# Altium project superhet1.PrjPcb (part 1 of 2)
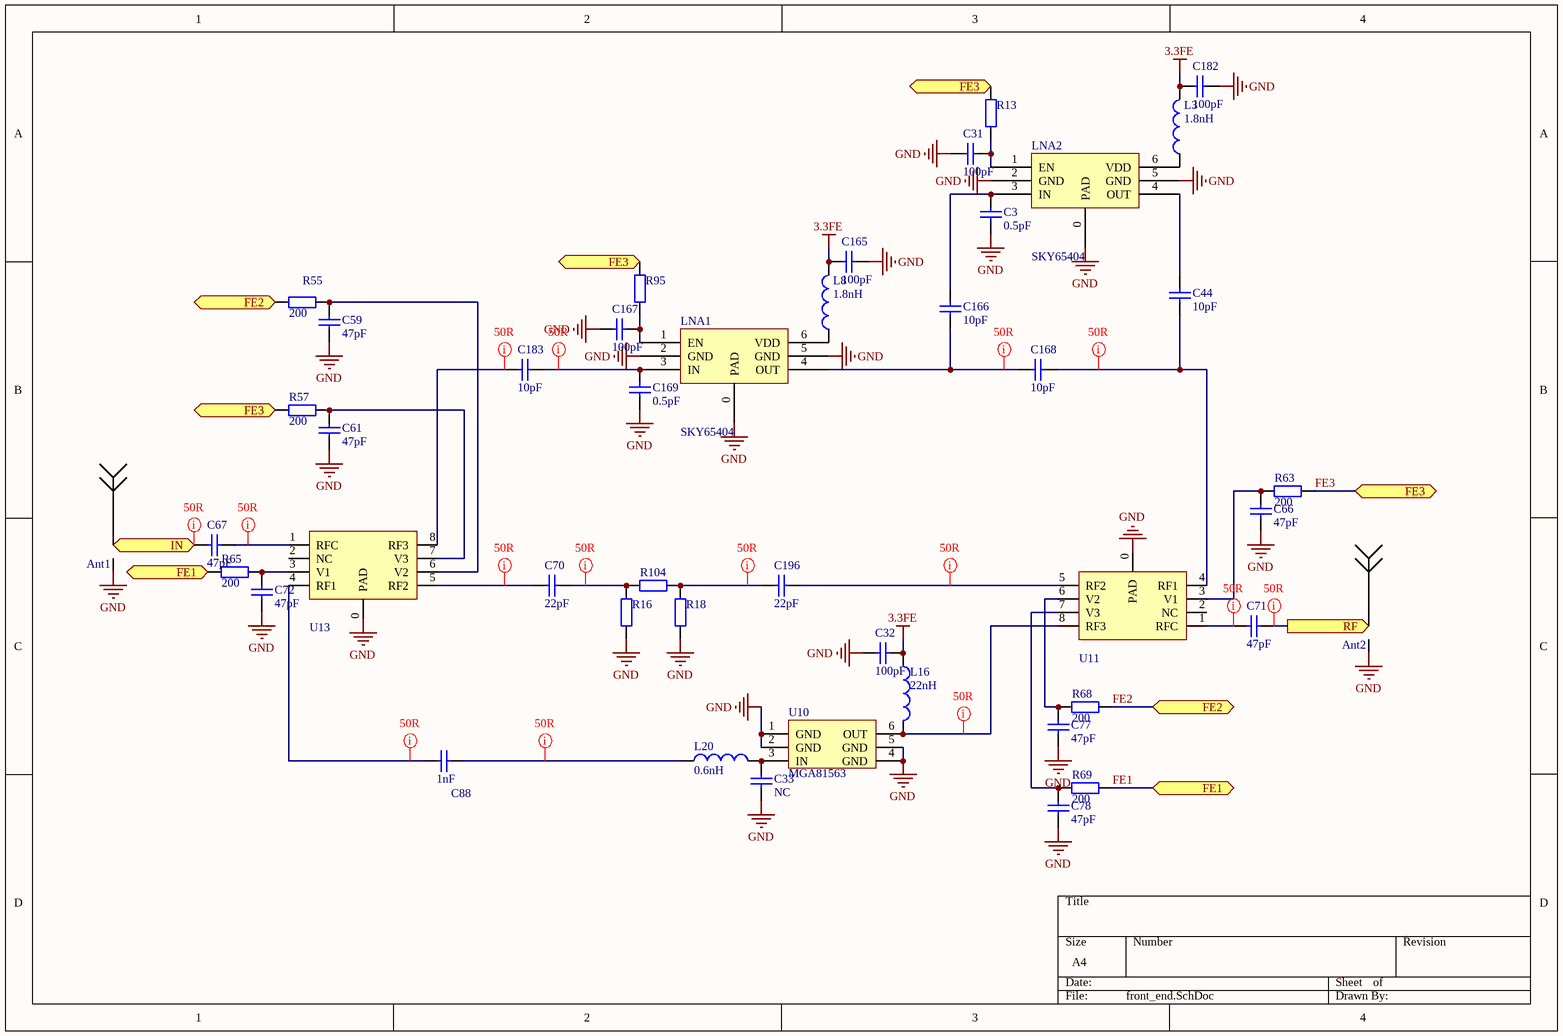
[diagram p0: front_end.SchDoc]
9 sheets, 440 parts. Net scope: flat (ports and power ports of the same name join across sheets).
Board file: superhet1.PcbDoc
Sheets:
  front_end.SchDoc
  mix1_LO1.SchDoc
  mix2_LO2.SchDoc
  LF_ADC.SchDoc
  FPGA.SchDoc
  mcu.SchDoc
  USB_HS_PHY.SchDoc
  power.SchDoc
  clock.SchDoc

## Sheet front_end.SchDoc
size A4

### Parts
Ant1  Antenna  [SMA-2]  (value not drawn)
Ant2  Antenna  [SMA-SMT]  (value not drawn)
C3  value 0.5pF  [0402]  (hidden comment: Cap)
C31  value 100pF  [0402]  (hidden comment: Cap)
C32  value 100pF  [0402]  (hidden comment: Cap)
C33  value NC  [0402]  (hidden comment: Cap)
C44  10pF  [0402]
C59  47pF  [0402]
C61  47pF  [0402]
C66  47pF  [0402]
C67  47pF  [0402]
C70  22pF  [0402]
C71  47pF  [0402]
C72  47pF  [0402]
C77  47pF  [0402]
C78  47pF  [0402]
C88  1nF  [0402]
C165  value 100pF  [0402]  (hidden comment: Cap)
C166  10pF  [0402]
C167  value 100pF  [0402]  (hidden comment: Cap)
C168  10pF  [0402]
C169  value 0.5pF  [0402]  (hidden comment: Cap)
C182  value 100pF  [0402]  (hidden comment: Cap)
C183  10pF  [0402]
C196  22pF  [0402]
L3  value 1.8nH  [0402]  (hidden comment: Inductor)
L8  value 1.8nH  [0402]  (hidden comment: Inductor)
L16  value 22nH  [0603]  (hidden comment: Inductor)
L20  value 0.6nH  [0402]  (hidden comment: Inductor)
LNA1  SKY65404  [SKY65404-31]
LNA2  SKY65404  [SKY65404-31]
R13  200R  [0402]  (value not drawn)
R16  TBD  [0402]  (value not drawn)
R18  TBD  [0402]  (value not drawn)
R55  200  [0402]
R57  200  [0402]
R63  200  [0402]
R65  200  [0402]
R68  200  [0402]
R69  200  [0402]
R95  200R  [0402]  (value not drawn)
R104  TBD  [0402]  (value not drawn)
U10  MGA81563  [SC-70-6]
U11  SKY13417  [SKY13317]  (value not drawn)
U13  SKY13417  [SKY13317]  (value not drawn)

### Ports
FE1, FE2, FE3, IN (in), RF (out)

### Nets
3.3FE: C32.2 C165.2 C182.2 L3.2 L8.2 L16.1
GND: Ant1.GND(G) Ant2.GND(G) C3.1 C31.2 C32.1 C33.1 C59.1 C61.1 C66.1 C72.1 C77.1 C78.1 C165.1 C167.2 C169.1 C182.1 LNA1.0(PAD) LNA1.2(GND) LNA1.5(GND) LNA2.0(PAD) LNA2.2(GND) LNA2.5(GND) R16.1 R18.2 U10.1(GND) U10.2(GND) U10.4(GND) U10.5(GND) U11.0(PAD) U13.0(PAD)
FE1: R65.1 R69.2 ; port FE1
FE2: R55.2 R68.2 ; port FE2
FE3: R13.2 R57.1 R63.2 R95.2 ; port FE3
NetAnt1_1: Ant1.1 C67.2 ; port IN
NetAnt2_1: Ant2.1 C71.1 ; port RF
NetC3_2: C3.2 C166.1 LNA2.3(IN)
NetC31_1: C31.1 LNA2.1(EN) R13.1
NetC33_2: C33.2 L20.2 U10.3(IN)
NetC44_1: C44.1 C168.1 U11.4(RF1)
NetC44_2: C44.2 LNA2.4(OUT)
NetC59_2: C59.2 R55.1 U13.6(V2)
NetC61_2: C61.2 R57.2 U13.7(V3)
NetC66_2: C66.2 R63.1 U11.3(V1)
NetC67_1: C67.1 U13.1(RFC)
NetC70_1: C70.1 R16.2 R104.2
NetC70_2: C70.2 U13.5(RF2)
NetC71_2: C71.2 U11.1(RFC)
NetC72_2: C72.2 R65.2 U13.3(V1)
NetC77_2: C77.2 R68.1 U11.6(V2)
NetC78_2: C78.2 R69.1 U11.7(V3)
NetC88_1: C88.1 L20.1
NetC88_2: C88.2 U13.4(RF1)
NetC166_2: C166.2 C168.2 LNA1.4(OUT)
NetC167_1: C167.1 LNA1.1(EN) R95.1
NetC169_2: C169.2 C183.2 LNA1.3(IN)
NetC183_1: C183.1 U13.8(RF3)
NetC196_1: C196.1 U11.5(RF2)
NetC196_2: C196.2 R18.1 R104.1
NetL3_1: L3.1 LNA2.6(VDD)
NetL8_1: L8.1 LNA1.6(VDD)
NetL16_2: L16.2 U10.6(OUT) U11.8(RF3)

Not connected (* = marked no-connect by the designer): U11 2(NC); U13 2(NC)

### Layout directives
net class 50R: NetAnt1_1, NetAnt2_1, NetC44_1, NetC67_1, NetC70_1, NetC70_2, NetC71_2, NetC88_1, NetC88_2, NetC166_2, NetC169_2, NetC183_1, NetC196_1, NetC196_2, NetL16_2

### Library data of the parts
C3 C31-C33 C44 C59 C61 C66 C67 C70-C72 C77 C78 C88 C165-C169 C182 C183 C196 = Cap: Capacitor; Published: 8-Jun-2000; LatestRevisionDate: 17-Jul-2002; LatestRevisionNote: Re-released for DXP Platform.; PackageReference: RAD-0.3; Publisher: Altium Limited; PackageDescription: Radial Cap, Thru-Hole; 2 Leads; 0.3 in Pin Spacing
L3 L8 L16 L20 = Inductor: Code_IEC: 1005; Published: 8-Jun-2000; LatestRevisionDate: 29-May-2009; LatestRevisionNote: IPC-7351 Footprint Added.; PackageReference: 0402-A; Publisher: Altium Limited; PackageDescription: Chip Inductor; Code_JEITA: 0402
LNA1 LNA2 = SKY65404-31
R13 R16 R18 R55 R57 R63 R65 R68 R69 R95 R104 = Res2: Resistor; Published: 8-Jun-2000; LatestRevisionDate: 17-Jul-2002; LatestRevisionNote: Re-released for DXP Platform.; PackageReference: AXIAL-0.4; Publisher: Altium Limited; PackageDescription: Axial Device, Thru-Hole; 2 Leads; 0.4 in Pin Spacing

## Sheet mix1_LO1.SchDoc
size A3
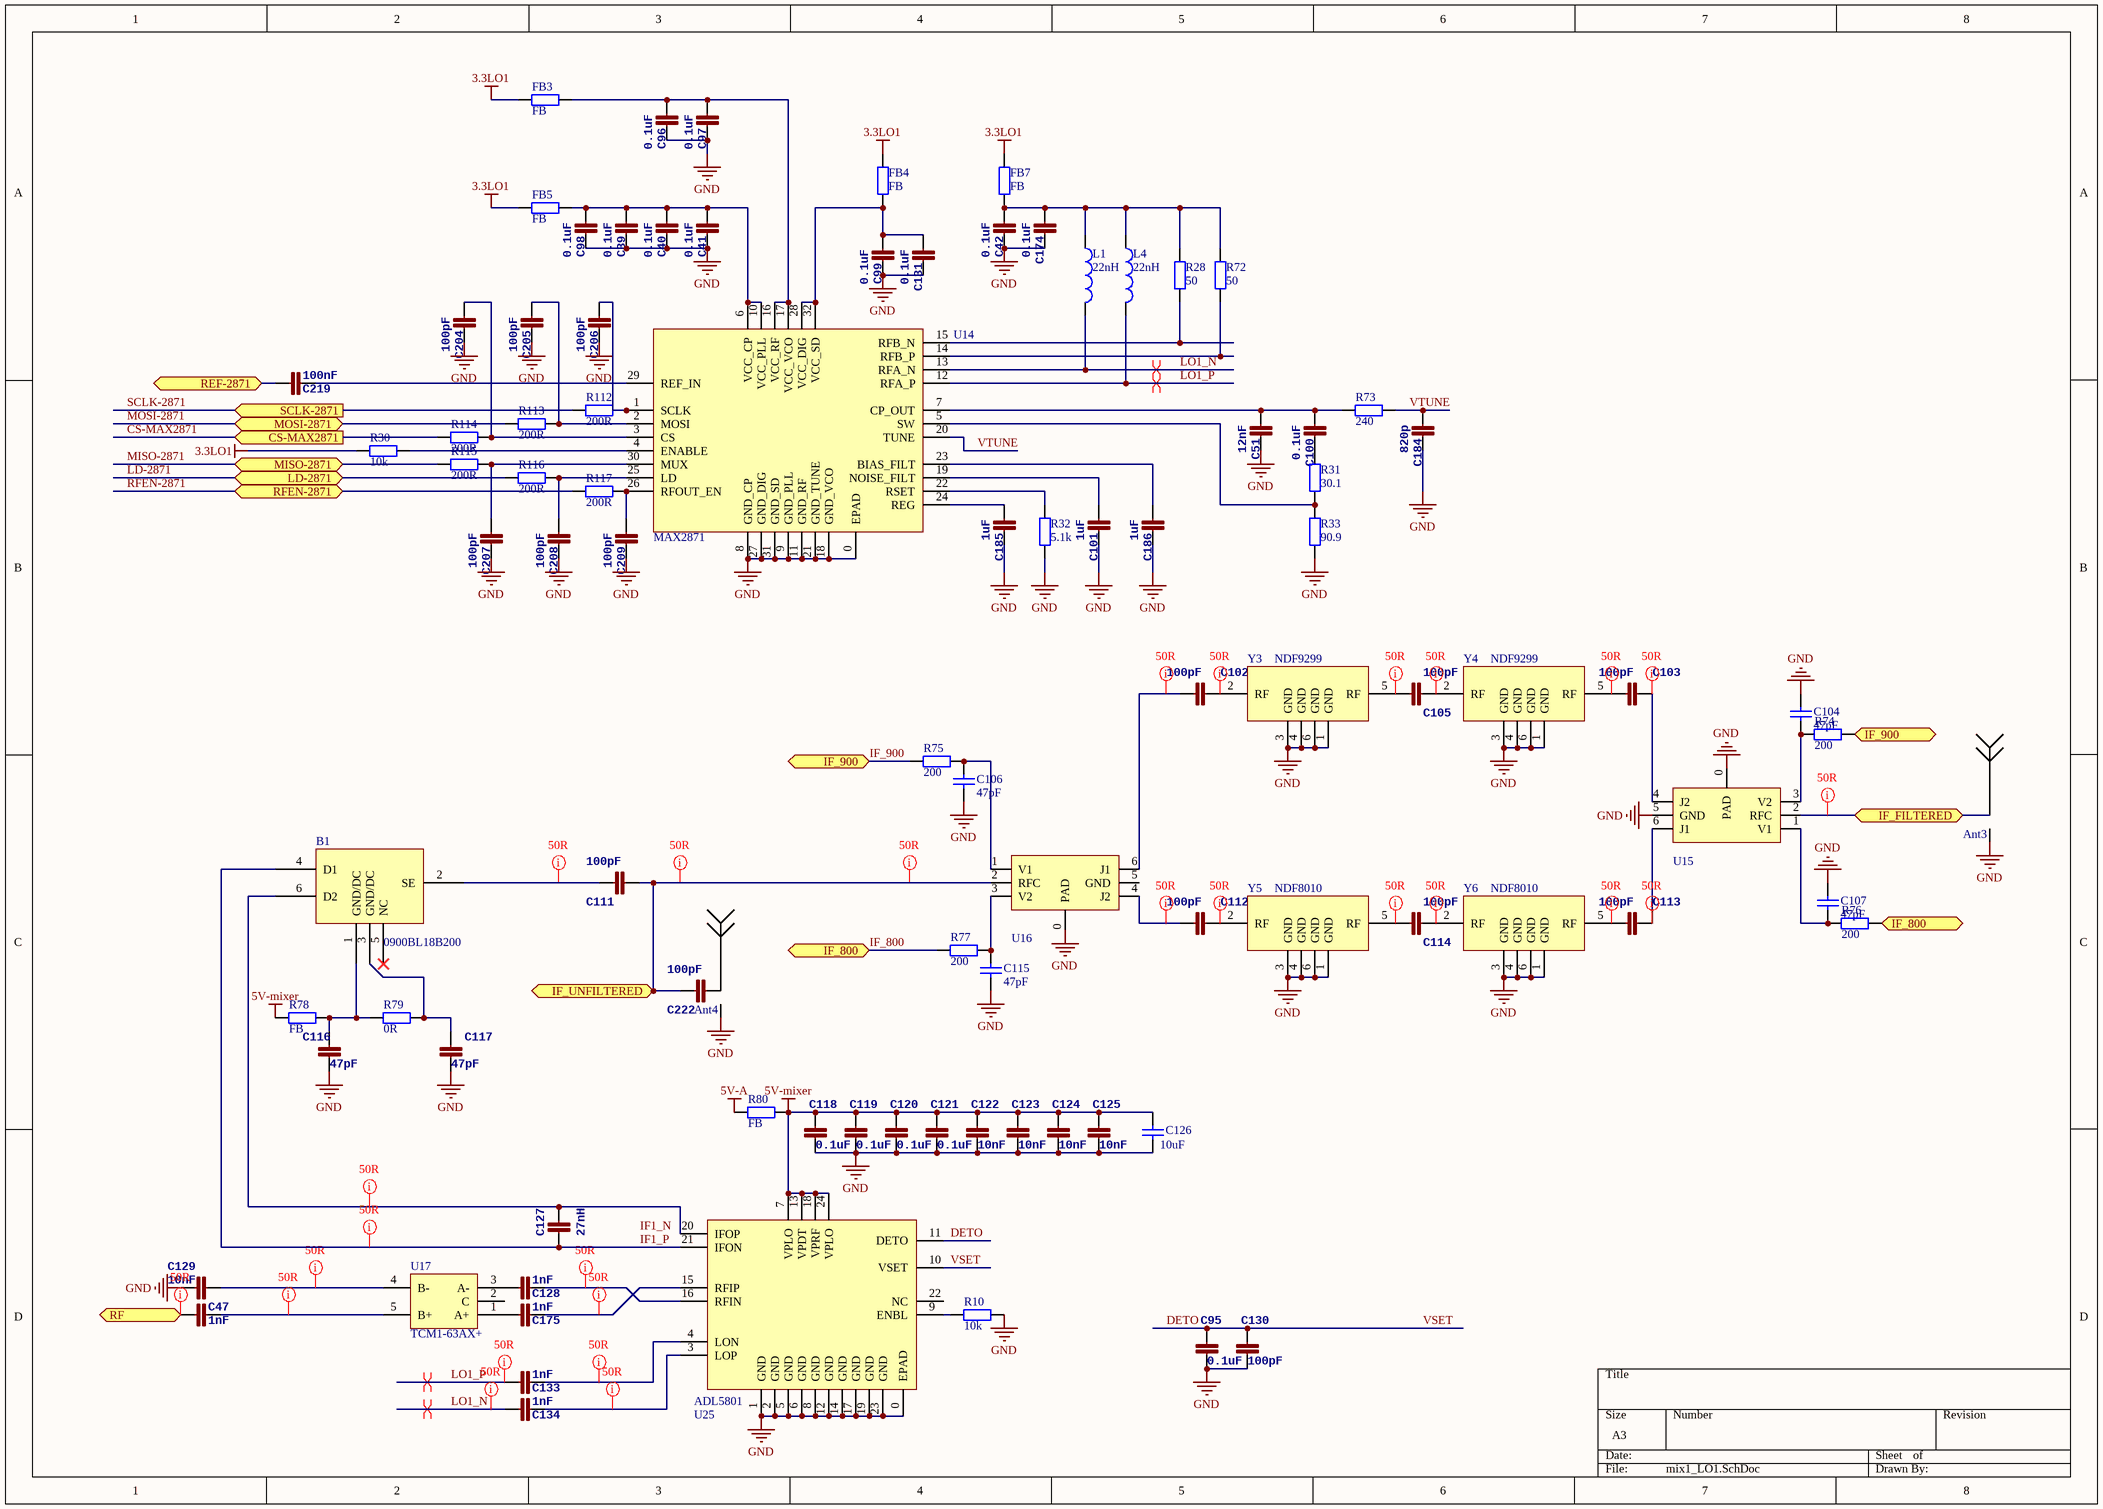
[diagram p1: mix1_LO1.SchDoc]

### Parts
Ant3  Antenna  [SMA-SMT]  (value not drawn)
Ant4  Antenna  [SMA-SMT]  (value not drawn)
B1  0900BL18B200  [0900BL18B200]
C39  0.1uF  [0402]
C40  0.1uF  [0402]
C41  0.1uF  [0402]
C42  0.1uF  [0402]
C47  1nF  [0402]
C51  12nF  [0402]
C95  0.1uF  [0402]
C96  0.1uF  [0402]
C97  0.1uF  [0402]
C98  0.1uF  [0402]
C99  0.1uF  [0402]
C100  0.1uF  [0402]
C101  1uF  [0402]
C102  100pF  [0402]
C103  100pF  [0402]
C104  47pF  [0402]
C105  100pF  [0402]
C106  47pF  [0402]
C107  47pF  [0402]
C111  100pF  [0402]
C112  100pF  [0402]
C113  100pF  [0402]
C114  100pF  [0402]
C115  47pF  [0402]
C116  47pF  [0402]
C117  47pF  [0402]
C118  0.1uF  [0402]
C119  0.1uF  [0402]
C120  0.1uF  [0402]
C121  0.1uF  [0402]
C122  10nF  [0402]
C123  10nF  [0402]
C124  10nF  [0402]
C125  10nF  [0402]
C126  10uF  [0805]
C127  27nH  [0402]
C128  1nF  [0402]
C129  10nF  [0402]
C130  100pF  [0402]
C131  0.1uF  [0402]
C133  1nF  [0402]
C134  1nF  [0402]
C174  0.1uF  [0402]
C175  1nF  [0402]
C184  820p  [0402]
C185  1uF  [0402]
C186  1uF  [0402]
C204  100pF  [0402]
C205  100pF  [0402]
C206  100pF  [0402]
C207  100pF  [0402]
C208  100pF  [0402]
C209  100pF  [0402]
C219  100nF  [0402]
C222  100pF  [0402]
FB3  FB  [0603]
FB4  FB  [0603]
FB5  FB  [0603]
FB7  FB  [0603]
L1  value 22nH  [0402]  (hidden comment: Inductor)
L4  value 22nH  [0402]  (hidden comment: Inductor)
R10  value 10k  [0402]  (hidden comment: Res2)
R28  50  [0402]
R30  10k  [0402]
R31  30.1  [0402]
R32  5.1k  [0402]
R33  90.9  [0402]
R72  50  [0402]
R73  240  [0402]
R74  200  [0402]
R75  200  [0402]
R76  200  [0402]
R77  200  [0402]
R78  FB  [0402]
R79  0R  [0402]
R80  FB  [0603]
R112  200R  [0402]
R113  200R  [0402]
R114  200R  [0402]
R115  200R  [0402]
R116  200R  [0402]
R117  200R  [0402]
U14  MAX2871  [MAX2871]
U15  SKY13320  [SKY65404-31]  (value not drawn)
U16  SKY13320  [SKY65404-31]  (value not drawn)
U17  TCM1-63AX+  [TCM-63AX+]
U25  ADL5801  [ADL5801]
Y3  NDF9299  [NDF8010]
Y4  NDF9299  [NDF8010]
Y5  NDF8010  [NDF8010]
Y6  NDF8010  [NDF8010]

### Ports
CS-MAX2871 (in), IF_800, IF_900, IF_FILTERED, IF_UNFILTERED, LD-2871, MISO-2871, MOSI-2871, REF-2871, RF, RFEN-2871, SCLK-2871 (in)

### Nets
3.3LO1: FB3.2 FB4.1 FB5.2 FB7.1 R30.2
5V-A: R80.1
5V-mixer: C118.2 C119.2 C120.2 C121.2 C122.2 C123.2 C124.2 C125.2 C126.2 R78.1 R80.2 U25.7(VPLO) U25.13(VPDT) U25.18(VPRF) U25.24(VPLO)
GND: Ant3.GND(G) Ant4.GND(G) C39.2 C40.2 C41.2 C42.2 C47.1 C51.2 C95.1 C96.2 C97.2 C98.2 C99.2 C101.2 C104.1 C106.1 C107.1 C115.1 C116.1 C117.1 C118.1 C119.1 C120.1 C121.1 C122.1 C123.1 C124.1 C125.1 C126.1 C130.1 C131.2 C174.2 C184.2 C185.2 C186.2 C204.2 C205.2 C206.2 C207.2 C208.2 C209.2 R10.2 R32.1 R33.1 U14.0(EPAD) U14.8(GND_CP) U14.9(GND_PLL) U14.11(GND_RF) U14.18(GND_VCO) U14.21(GND_TUNE) U14.27(GND_DIG) U14.31(GND_SD) U15.0(PAD) U15.5(GND) U16.0(PAD) U25.0(EPAD) U25.1(GND) U25.2(GND) U25.5(GND) U25.6(GND) U25.8(GND) U25.12(GND) U25.14(GND) U25.17(GND) U25.19(GND) U25.23(GND) Y3.1(GND) Y3.3(GND) Y3.4(GND) Y3.6(GND) Y4.1(GND) Y4.3(GND) Y4.4(GND) Y4.6(GND) Y5.1(GND) Y5.3(GND) Y5.4(GND) Y5.6(GND) Y6.1(GND) Y6.3(GND) Y6.4(GND) Y6.6(GND)
CS-MAX2871: R114.2 ; port CS-MAX2871
DETO: C95.2 C130.2 U25.10(VSET) U25.11(DETO)  [also labelled VSET]
IF1_P: B1.4(D1) C127.2 U25.21(IFON)
IF_800: R76.1 R77.1 ; port IF_800
IF_900: R74.1 R75.1 ; port IF_900
LD-2871: R116.2 ; port LD-2871
LO1_N: C134.1 L1.2 U14.13(RFA_N)
LO1_P: C133.1 L4.2 U14.12(RFA_P)
MISO-2871: R115.2 ; port MISO-2871
MOSI-2871: R113.2 ; port MOSI-2871
RFEN-2871: R117.2 ; port RFEN-2871
SCLK-2871: R112.2 ; port SCLK-2871
VTUNE: C184.1 R73.1 U14.20(TUNE)
NetAnt2_1: C129.2 ; port RF
NetAnt3_1: Ant3.1 U15.2(RFC) ; port IF_FILTERED
NetAnt4_1: Ant4.1 C222.1
NetB1_1: B1.1(GND/DC) C116.2 R78.2 R79.1
NetB1_2: B1.2(SE) C111.2
NetB1_3: B1.3(GND/DC) C117.2 R79.2
NetB1_6: B1.6(D2) C127.1 U25.20(IFOP)
NetC39_1: C39.1 C40.1 C41.1 C98.1 FB5.1 U14.6(VCC_CP) U14.10(VCC_PLL)
NetC42_1: C42.1 C174.1 FB7.2 L1.1 L4.1 R28.1 R72.1
NetC47_2: C47.2 U17.4(B-)
NetC51_1: C51.1 C100.1 R73.2 U14.7(CP_OUT)
NetC96_1: C96.1 C97.1 FB3.1 U14.16(VCC_RF) U14.17(VCC_VCO)
NetC99_1: C99.1 C131.1 FB4.2 U14.28(VCC_DIG) U14.32(VCC_SD)
NetC100_2: C100.2 R31.2
NetC101_1: C101.1 U14.19(NOISE_FILT)
NetC102_1: C102.1 Y3.2(RF)
NetC102_2: C102.2 U16.6(J1)
NetC103_1: C103.1 U15.4(J2)
NetC103_2: C103.2 Y4.5(RF)
NetC104_2: C104.2 R74.2 U15.3(V2)
NetC105_1: C105.1 Y4.2(RF)
NetC105_2: C105.2 Y3.5(RF)
NetC106_2: C106.2 R75.2 U16.1(V1)
NetC107_2: C107.2 R76.2 U15.1(V1)
NetC111_1: C111.1 C222.2 U16.2(RFC) ; port IF_UNFILTERED
NetC112_1: C112.1 Y5.2(RF)
NetC112_2: C112.2 U16.4(J2)
NetC113_1: C113.1 U15.6(J1)
NetC113_2: C113.2 Y6.5(RF)
NetC114_1: C114.1 Y6.2(RF)
NetC114_2: C114.2 Y5.5(RF)
NetC115_2: C115.2 R77.2 U16.3(V2)
NetC128_1: C128.1 U17.3(A-)
NetC128_2: C128.2 U25.16(RFIN)
NetC129_1: C129.1 U17.5(B+)
NetC133_2: C133.2 U25.4(LON)
NetC134_2: C134.2 U25.3(LOP)
NetC175_1: C175.1 U17.1(A+)
NetC175_2: C175.2 U25.15(RFIP)
NetC185_1: C185.1 U14.24(REG)
NetC186_1: C186.1 U14.23(BIAS_FILT)
NetC204_1: C204.1 R114.1 U14.3(CS)
NetC205_1: C205.1 R113.1 U14.2(MOSI)
NetC206_1: C206.1 R112.1 U14.1(SCLK)
NetC207_1: C207.1 R115.1 U14.30(MUX)
NetC208_1: C208.1 R116.1 U14.25(LD)
NetC209_1: C209.1 R117.1 U14.26(RFOUT_EN)
NetC219_1: C219.1 ; port REF-2871
NetC219_2: C219.2 U14.29(REF_IN)
NetR10_1: R10.1 U25.9(ENBL)
NetR28_2: R28.2 U14.15(RFB_N)
NetR30_1: R30.1 U14.4(ENABLE)
NetR31_1: R31.1 R33.2 U14.5(SW)
NetR32_2: R32.2 U14.22(RSET)
NetR72_2: R72.2 U14.14(RFB_P)

Not connected (* = marked no-connect by the designer): B1 5(NC)*; U16 5(GND); U17 2(C); U25 22(NC)

### Layout directives
differential pair: LO1_N, LO1_P
net class 50R: IF1_P, LO1_N, LO1_P, NetAnt2_1, NetAnt3_1, NetB1_2, NetB1_6, NetC47_2, NetC102_1, NetC102_2, NetC103_1, NetC103_2, NetC105_1, NetC105_2, NetC111_1, NetC112_1, NetC112_2, NetC113_1, NetC113_2, NetC114_1, NetC114_2, NetC128_2, NetC129_1, NetC133_2, NetC134_2, NetC175_2

### Notes on the sheet
- Labels drawn without touching a wire or pin: IF1_N

### Library data of the parts
C39-C42 C47 C51 C95-C103 C105 C111-C114 C116-C125 C127-C131 C133 C134 C174 C175 C184-C186 C204-C209 C219 C222 = CAP0402-CAP: <b>Capacitor</b> / Standard 0603 ceramic capacitor, and 0.1" leaded capacitor.; PARTNO: CC0402ZRY5V7BB104
C104 C106 C107 C115 C126 = Cap: Capacitor; Published: 8-Jun-2000; LatestRevisionDate: 17-Jul-2002; LatestRevisionNote: Re-released for DXP Platform.; PackageReference: RAD-0.3; Publisher: Altium Limited; PackageDescription: Radial Cap, Thru-Hole; 2 Leads; 0.3 in Pin Spacing
FB3-FB5 FB7 R10 R28 R30-R33 R72-R77 R112-R117 = Res2: Resistor; Published: 8-Jun-2000; LatestRevisionDate: 17-Jul-2002; LatestRevisionNote: Re-released for DXP Platform.; PackageReference: AXIAL-0.4; Publisher: Altium Limited; PackageDescription: Axial Device, Thru-Hole; 2 Leads; 0.4 in Pin Spacing
L1 L4 = Inductor: Code_IEC: 1005; Published: 8-Jun-2000; LatestRevisionDate: 29-May-2009; LatestRevisionNote: IPC-7351 Footprint Added.; PackageReference: 0402-A; Publisher: Altium Limited; PackageDescription: Chip Inductor; Code_JEITA: 0402
R78-R80 = Res2: Resistor; Value: 0Ohm; Published: 8-Jun-2000; LatestRevisionDate: 17-Jul-2002; LatestRevisionNote: Re-released for DXP Platform.; PackageReference: AXIAL-0.4; Publisher: Altium Limited; PackageDescription: Axial Device, Thru-Hole; 2 Leads; 0.4 in Pin Spacing
U17 = TCM-63AX+
Y3 Y4 = NDF8010

## Sheet mix2_LO2.SchDoc
size A3
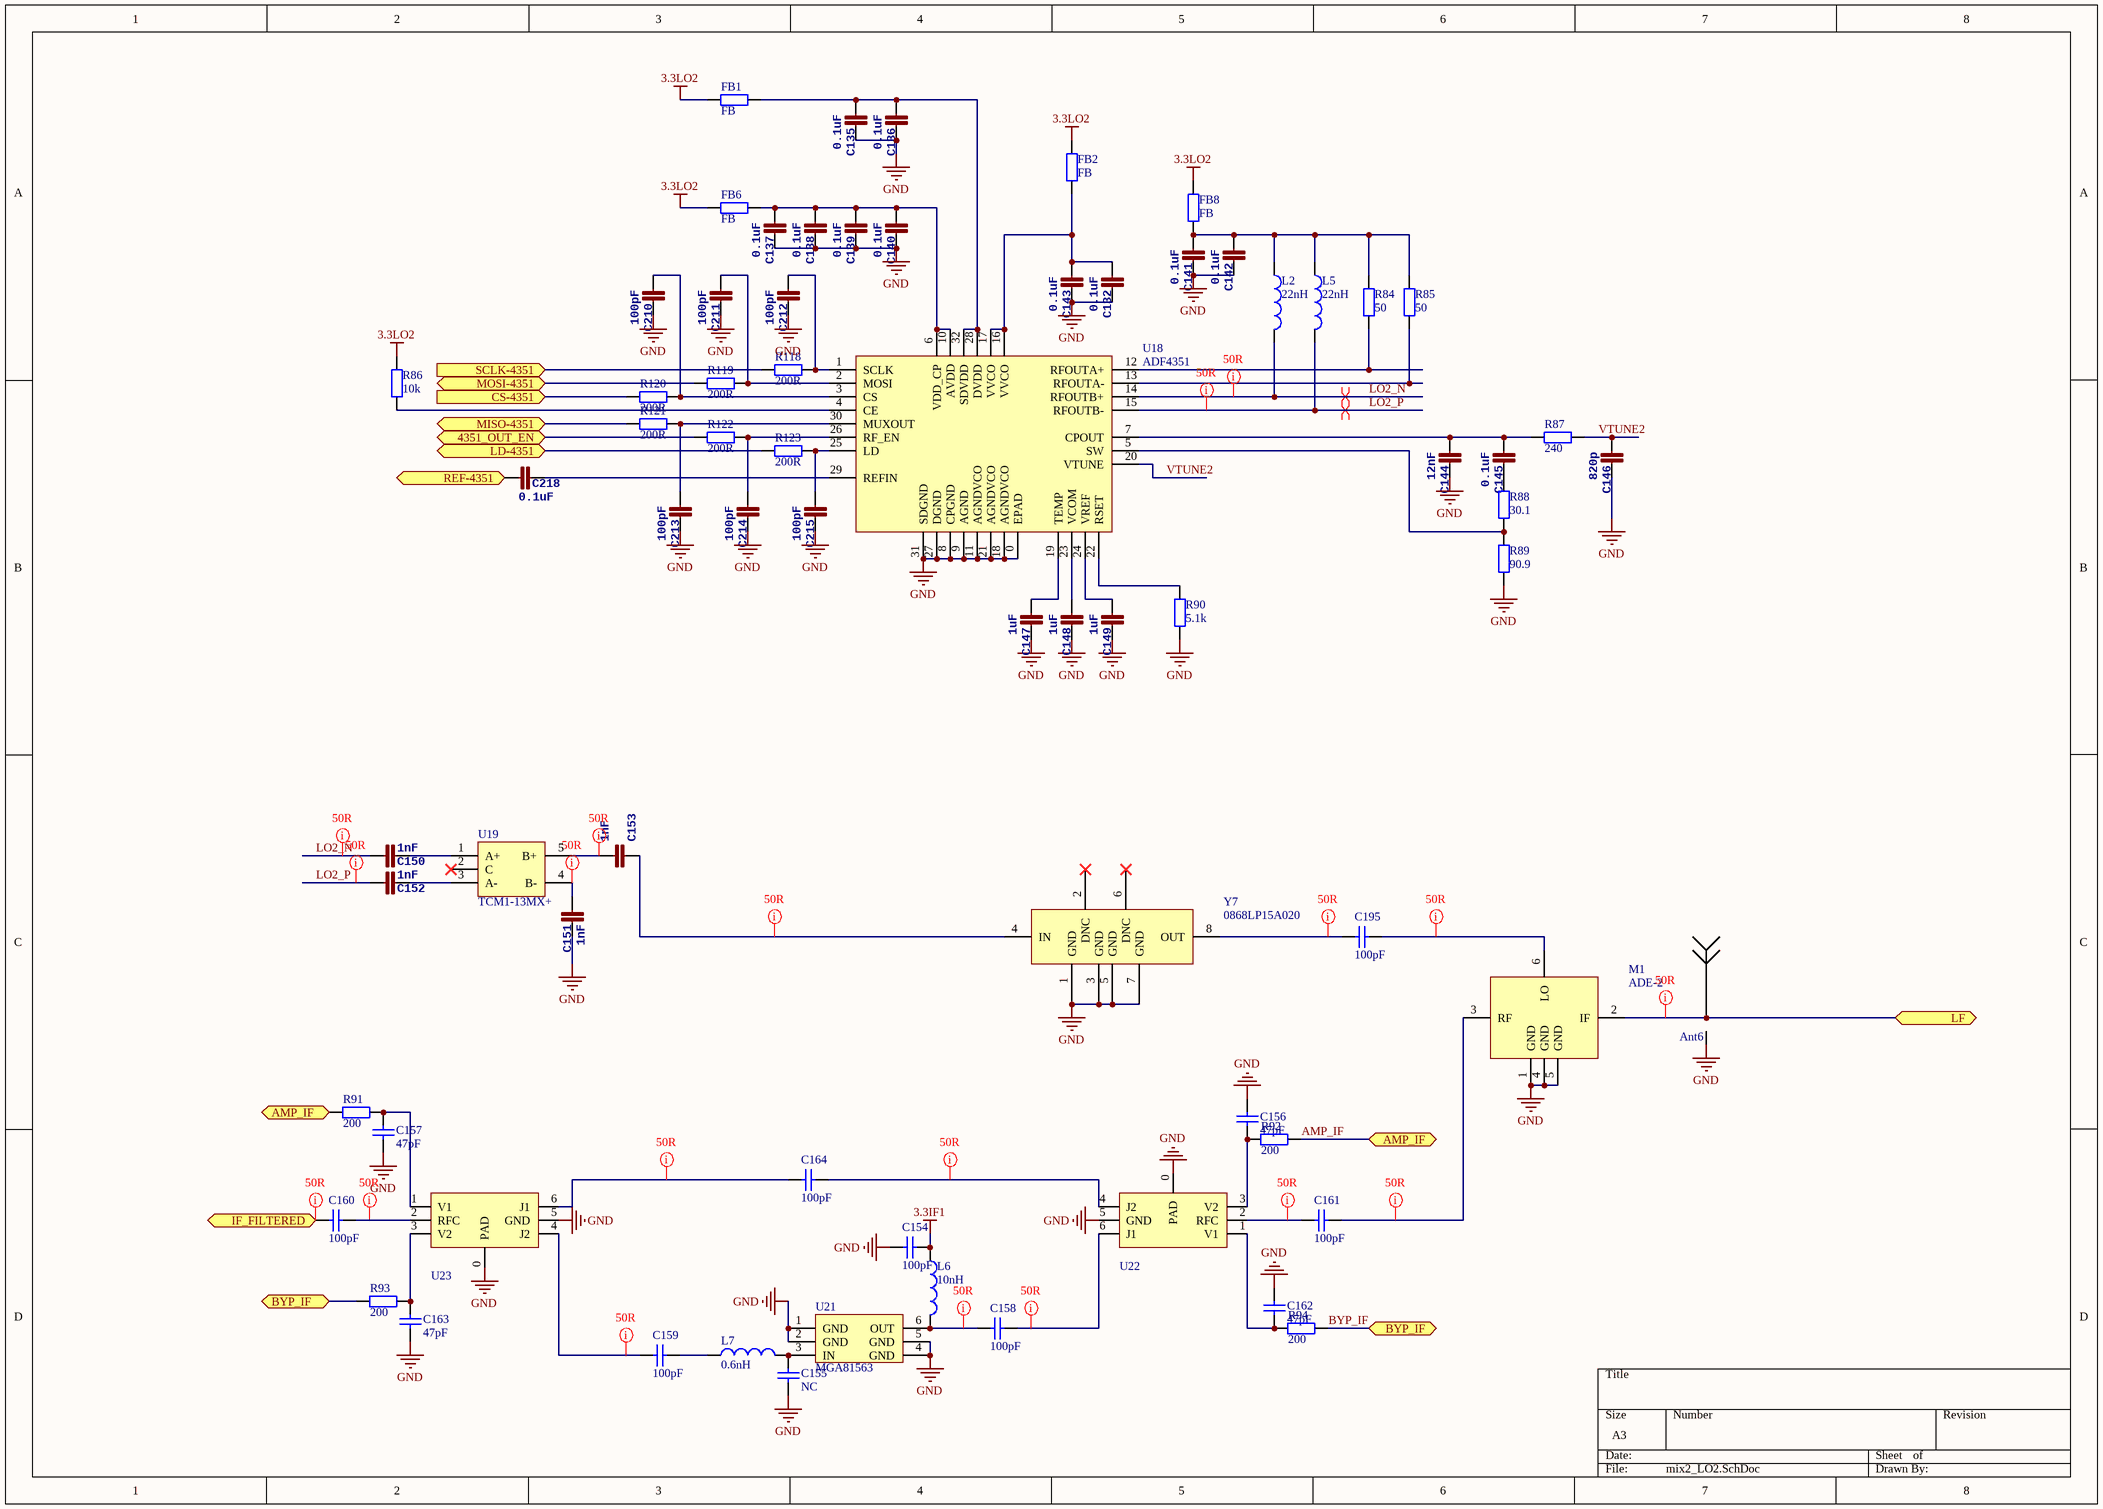
[diagram p2: mix2_LO2.SchDoc]

### Parts
Ant6  Antenna  [SMA-SMT]  (value not drawn)
C132  0.1uF  [0402]
C135  0.1uF  [0402]
C136  0.1uF  [0402]
C137  0.1uF  [0402]
C138  0.1uF  [0402]
C139  0.1uF  [0402]
C140  0.1uF  [0402]
C141  0.1uF  [0402]
C142  0.1uF  [0402]
C143  0.1uF  [0402]
C144  12nF  [0402]
C145  0.1uF  [0402]
C146  820p  [0402]
C147  1uF  [0402]
C148  1uF  [0402]
C149  1uF  [0402]
C150  1nF  [0402]
C151  1nF  [0402]
C152  1nF  [0402]
C153  1nF  [0402]
C154  value 100pF  [0402]  (hidden comment: Cap)
C155  value NC  [0402]  (hidden comment: Cap)
C156  47pF  [0402]
C157  47pF  [0402]
C158  value 100pF  [0402]  (hidden comment: Cap)
C159  value 100pF  [0402]  (hidden comment: Cap)
C160  100pF  [0402]
C161  100pF  [0402]
C162  47pF  [0402]
C163  47pF  [0402]
C164  value 100pF  [0402]  (hidden comment: Cap)
C195  100pF  [0402]
C210  100pF  [0402]
C211  100pF  [0402]
C212  100pF  [0402]
C213  100pF  [0402]
C214  100pF  [0402]
C215  100pF  [0402]
C218  0.1uF  [0402]
FB1  FB  [0603]
FB2  FB  [0603]
FB6  FB  [0603]
FB8  FB  [0603]
L2  value 22nH  [0402]  (hidden comment: Inductor)
L5  value 22nH  [0402]  (hidden comment: Inductor)
L6  value 10nH  [0603]  (hidden comment: Inductor)
L7  value 0.6nH  [0402]  (hidden comment: Inductor)
M1  ADE-2  [ADE-2]
R84  50  [0402]
R85  50  [0402]
R86  10k  [0402]
R87  240  [0402]
R88  30.1  [0402]
R89  90.9  [0402]
R90  5.1k  [0402]
R91  200  [0402]
R92  200  [0402]
R93  200  [0402]
R94  200  [0402]
R118  200R  [0402]
R119  200R  [0402]
R120  200R  [0402]
R121  200R  [0402]
R122  200R  [0402]
R123  200R  [0402]
U18  ADF4351  [ADF4351]
U19  TCM1-13MX+  [TCM-63AX+]
U21  MGA81563  [SC-70-6]
U22  SKY13320  [SKY65404-31]  (value not drawn)
U23  SKY13320  [SKY65404-31]  (value not drawn)
Y7  0868LP15A020  [5515LP15A730/0868LP15A020]

### Ports
4351_OUT_EN, AMP_IF, BYP_IF, CS-4351 (in), IF_FILTERED, LD-4351, LF, MISO-4351, MOSI-4351, REF-4351, SCLK-4351 (in)

### Nets
3.3IF1: C154.2 L6.1
3.3LO2: FB1.2 FB2.1 FB6.2 FB8.1 R86.2
GND: Ant6.GND(G) C132.2 C135.2 C136.2 C137.2 C138.2 C139.2 C140.2 C141.2 C142.2 C143.2 C144.2 C146.2 C147.2 C148.2 C149.2 C151.2 C154.1 C155.1 C156.1 C157.1 C162.1 C163.1 C210.2 C211.2 C212.2 C213.2 C214.2 C215.2 M1.1(GND) M1.4(GND) M1.5(GND) R89.1 R90.1 U18.0(EPAD) U18.8(CPGND) U18.9(AGND) U18.11(AGNDVCO) U18.18(AGNDVCO) U18.21(AGNDVCO) U18.27(DGND) U18.31(SDGND) U21.1(GND) U21.2(GND) U21.4(GND) U21.5(GND) U22.0(PAD) U22.5(GND) U23.0(PAD) U23.5(GND) Y7.1(GND) Y7.3(GND) Y7.5(GND) Y7.7(GND)
AMP_IF: R91.1 R92.1 ; port AMP_IF
BYP_IF: R93.1 R94.1 ; port BYP_IF
LO2_N: C150.1 L2.2 U18.14(RFOUTB+)
LO2_P: C152.1 L5.2 U18.15(RFOUTB-)
VTUNE2: C146.1 R87.1 U18.20(VTUNE)
NetAnt3_1: C160.2 ; port IF_FILTERED
NetAnt6_1: Ant6.1 M1.2(IF) ; port LF
NetC132_1: C132.1 C143.1 FB2.2 U18.16(VVCO) U18.17(VVCO)
NetC135_1: C135.1 C136.1 FB1.1 U18.28(DVDD) U18.32(SDVDD)
NetC137_1: C137.1 C138.1 C139.1 C140.1 FB6.1 U18.6(VDD_CP) U18.10(AVDD)
NetC141_1: C141.1 C142.1 FB8.2 L2.1 L5.1 R84.1 R85.1
NetC144_1: C144.1 C145.1 R87.2 U18.7(CPOUT)
NetC145_2: C145.2 R88.2
NetC147_1: C147.1 U18.19(TEMP)
NetC148_1: C148.1 U18.23(VCOM)
NetC149_1: C149.1 U18.24(VREF)
NetC150_2: C150.2 U19.1(A+)
NetC151_1: C151.1 U19.4(B-)
NetC152_2: C152.2 U19.3(A-)
NetC153_1: C153.1 U19.5(B+)
NetC153_2: C153.2 Y7.4(IN)
NetC155_2: C155.2 L7.2 U21.3(IN)
NetC156_2: C156.2 R92.2 U22.3(V2)
NetC157_2: C157.2 R91.2 U23.1(V1)
NetC158_1: C158.1 L6.2 U21.6(OUT)
NetC158_2: C158.2 U22.6(J1)
NetC159_1: C159.1 U23.4(J2)
NetC159_2: C159.2 L7.1
NetC160_1: C160.1 U23.2(RFC)
NetC161_1: C161.1 U22.2(RFC)
NetC161_2: C161.2 M1.3(RF)
NetC162_2: C162.2 R94.2 U22.1(V1)
NetC163_2: C163.2 R93.2 U23.3(V2)
NetC164_1: C164.1 U23.6(J1)
NetC164_2: C164.2 U22.4(J2)
NetC195_1: C195.1 Y7.8(OUT)
NetC195_2: C195.2 M1.6(LO)
NetC210_1: C210.1 R120.1 U18.3(CS)
NetC211_1: C211.1 R119.1 U18.2(MOSI)
NetC212_1: C212.1 R118.1 U18.1(SCLK)
NetC213_1: C213.1 R121.1 U18.30(MUXOUT)
NetC214_1: C214.1 R122.1 U18.26(RF_EN)
NetC215_1: C215.1 R123.1 U18.25(LD)
NetC218_1: C218.1 ; port REF-4351
NetC218_2: C218.2 U18.29(REFIN)
NetR84_2: R84.2 U18.12(RFOUTA+)
NetR85_2: R85.2 U18.13(RFOUTA-)
NetR86_1: R86.1 U18.4(CE)
NetR88_1: R88.1 R89.2 U18.5(SW)
NetR90_2: R90.2 U18.22(RSET)
NetR118_2: R118.2 ; port SCLK-4351
NetR119_2: R119.2 ; port MOSI-4351
NetR120_2: R120.2 ; port CS-4351
NetR121_2: R121.2 ; port MISO-4351
NetR122_2: R122.2 ; port 4351_OUT_EN
NetR123_2: R123.2 ; port LD-4351

Not connected (* = marked no-connect by the designer): U19 2(C)*; Y7 2(DNC)* 6(DNC)*

### Layout directives
differential pair: LO2_N, LO2_P
net class 50R: LO2_N, LO2_P, NetAnt3_1, NetAnt6_1, NetC151_1, NetC153_1, NetC153_2, NetC158_1, NetC158_2, NetC159_1, NetC160_1, NetC161_1, NetC161_2, NetC164_1, NetC164_2, NetC195_1, NetC195_2

### Library data of the parts
C132 C135-C153 C210-C215 C218 = CAP0402-CAP: as C39 on sheet mix1_LO1
C154-C164 C195 = Cap: Capacitor; Published: 8-Jun-2000; LatestRevisionDate: 17-Jul-2002; LatestRevisionNote: Re-released for DXP Platform.; PackageReference: RAD-0.3; Publisher: Altium Limited; PackageDescription: Radial Cap, Thru-Hole; 2 Leads; 0.3 in Pin Spacing
FB1 FB2 FB6 FB8 R84-R94 R118-R123 = Res2: Resistor; Published: 8-Jun-2000; LatestRevisionDate: 17-Jul-2002; LatestRevisionNote: Re-released for DXP Platform.; PackageReference: AXIAL-0.4; Publisher: Altium Limited; PackageDescription: Axial Device, Thru-Hole; 2 Leads; 0.4 in Pin Spacing
L2 L5-L7 = Inductor: Code_IEC: 1005; Published: 8-Jun-2000; LatestRevisionDate: 29-May-2009; LatestRevisionNote: IPC-7351 Footprint Added.; PackageReference: 0402-A; Publisher: Altium Limited; PackageDescription: Chip Inductor; Code_JEITA: 0402
U19 = TCM-63AX+
Y7 = 5515LP15A730/0868LP15A020

## Sheet LF_ADC.SchDoc
size A3
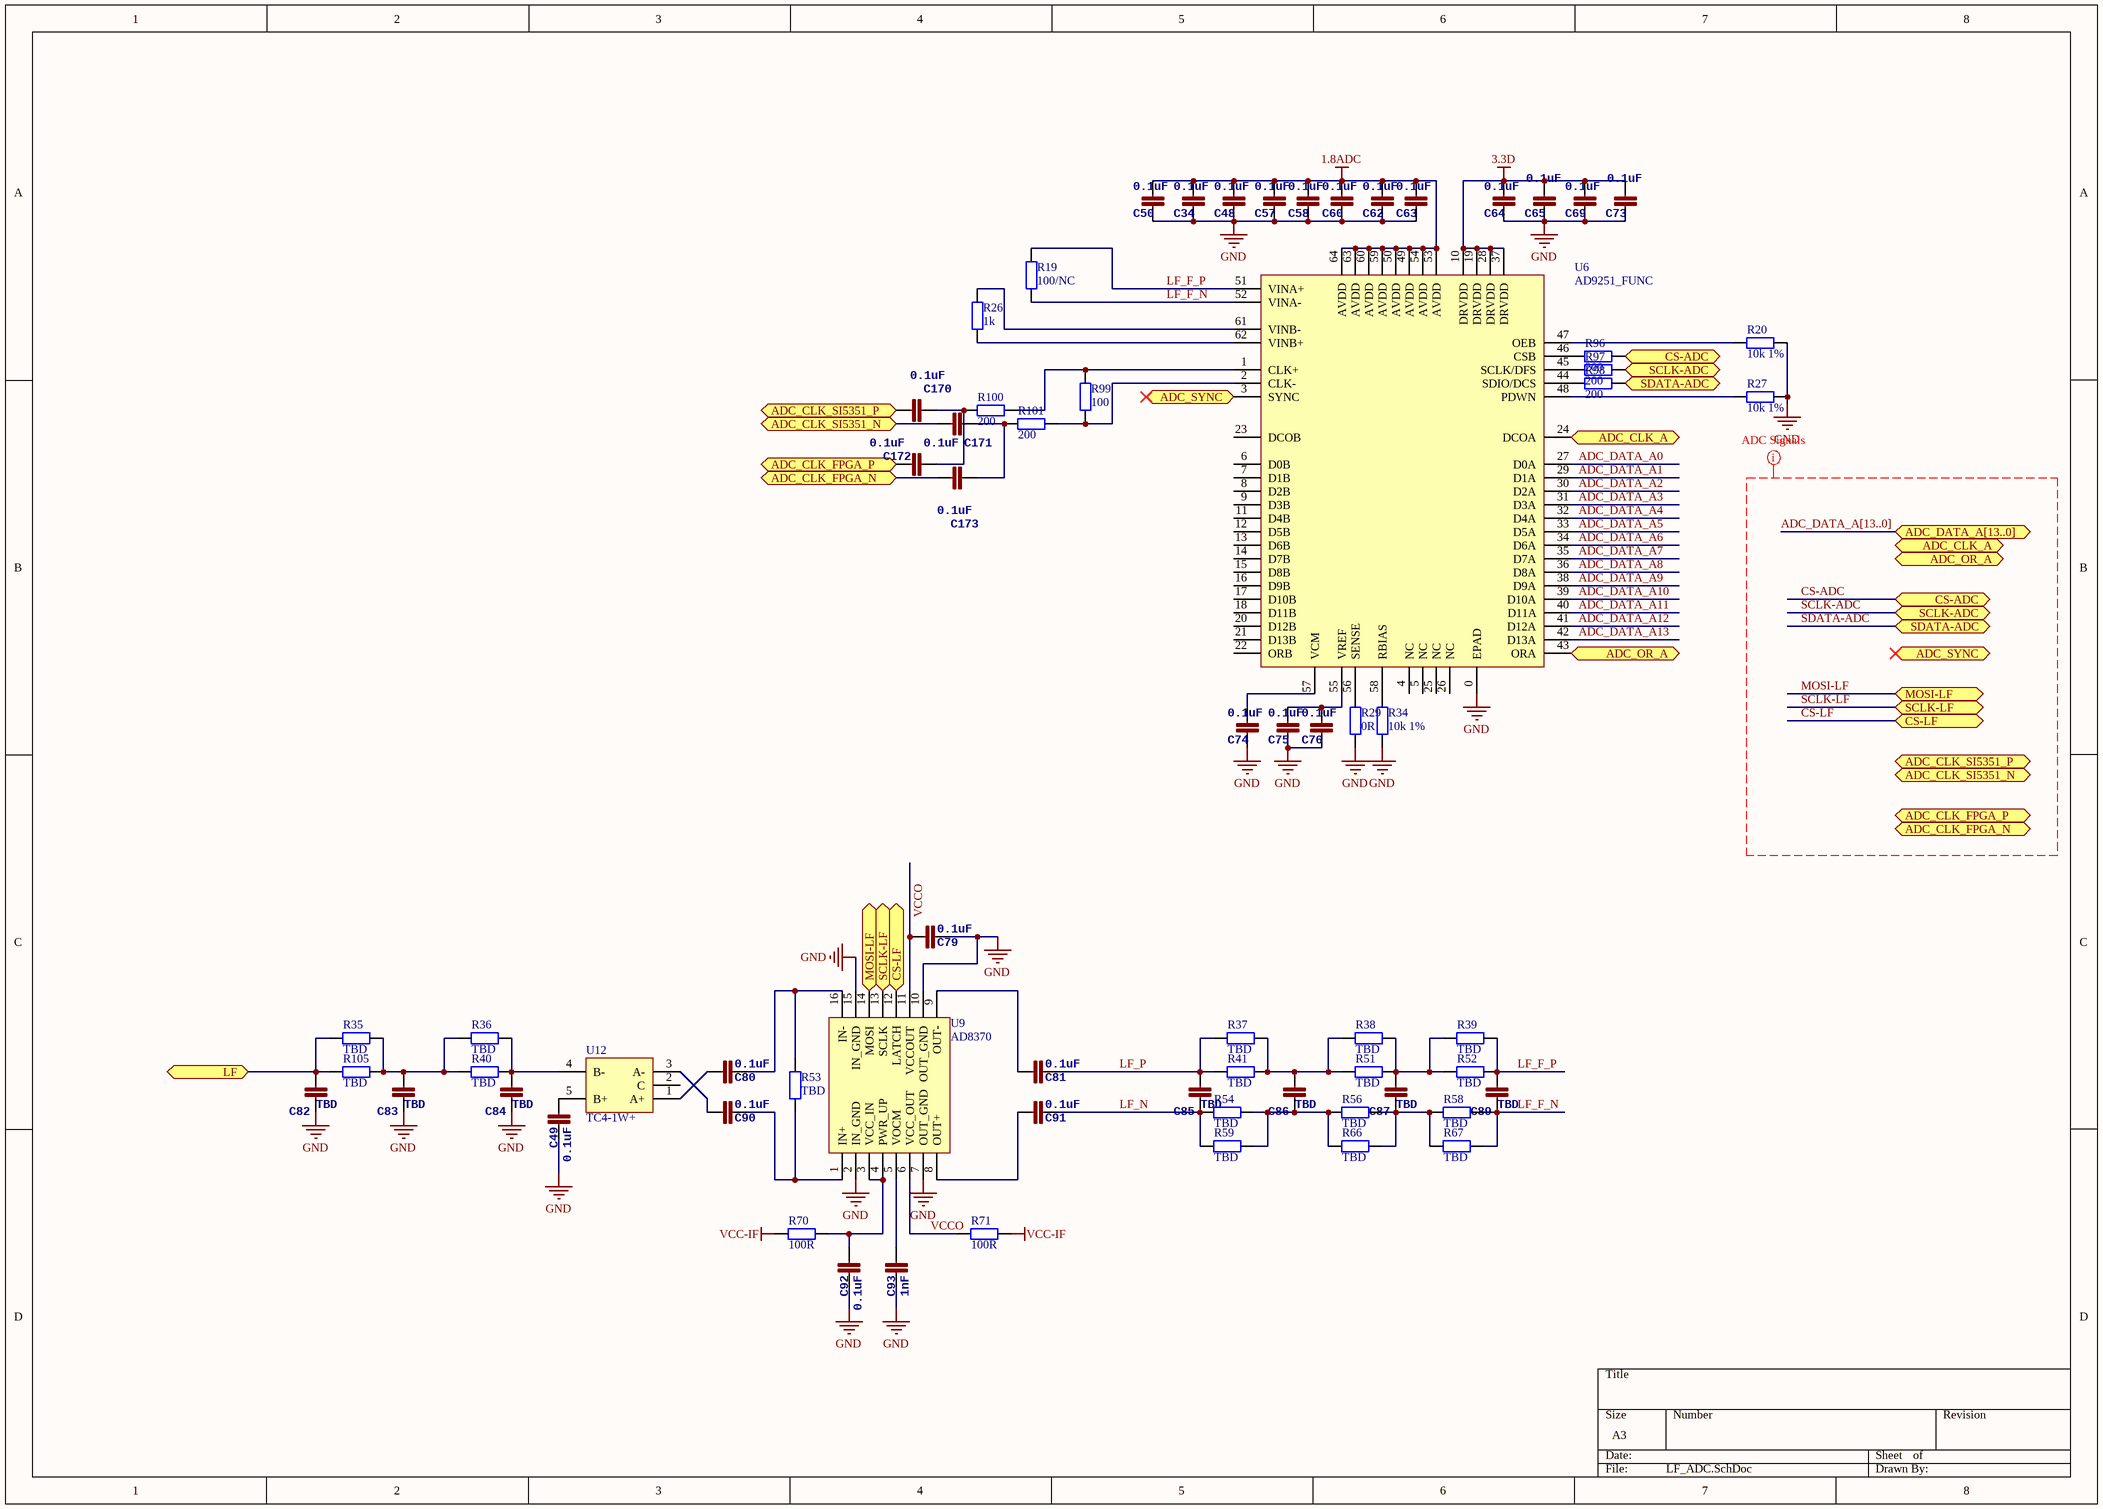
[diagram p3: LF_ADC.SchDoc]

### Parts
C34  0.1uF  [0402]
C48  0.1uF  [0402]
C49  0.1uF  [0402]
C50  0.1uF  [0402]
C57  0.1uF  [0402]
C58  0.1uF  [0402]
C60  0.1uF  [0402]
C62  0.1uF  [0402]
C63  0.1uF  [0402]
C64  0.1uF  [0402]
C65  0.1uF  [0402]
C69  0.1uF  [0402]
C73  0.1uF  [0402]
C74  0.1uF  [0402]
C75  0.1uF  [0402]
C76  0.1uF  [0402]
C79  0.1uF  [0402]
C80  0.1uF  [0402]
C81  0.1uF  [0402]
C82  TBD  [0402]
C83  TBD  [0402]
C84  TBD  [0402]
C85  TBD  [0402]
C86  TBD  [0402]
C87  TBD  [0402]
C89  TBD  [0402]
C90  0.1uF  [0402]
C91  0.1uF  [0402]
C92  0.1uF  [0402]
C93  1nF  [0402]
C170  0.1uF  [0402]
C171  0.1uF  [0402]
C172  0.1uF  [0402]
C173  0.1uF  [0402]
R19  100/NC  [0402]
R20  10k 1%  [0402]
R26  1k  [0402]
R27  10k 1%  [0402]
R29  0R  [0402]
R34  10k 1%  [0402]
R35  TBD  [0402]
R36  TBD  [0402]
R37  TBD  [0402]
R38  TBD  [0402]
R39  TBD  [0402]
R40  TBD  [0402]
R41  TBD  [0402]
R51  TBD  [0402]
R52  TBD  [0402]
R53  TBD  [0402]
R54  TBD  [0402]
R56  TBD  [0402]
R58  TBD  [0402]
R59  TBD  [0402]
R66  TBD  [0402]
R67  TBD  [0402]
R70  100R  [0402]
R71  100R  [0402]
R96  200  [0402]
R97  200  [0402]
R98  200  [0402]
R99  100  [0402]
R100  200  [0402]
R101  200  [0402]
R105  TBD  [0402]
U6  AD9251_FUNC  [AD9251]
U9  AD8370  [TSSOP16_44MM_065P - duplicate]
U12  TC4-1W+  [TCM-63AX+]

### Ports
ADC_CLK_A, ADC_CLK_FPGA_N, ADC_CLK_FPGA_P, ADC_CLK_SI5351_N, ADC_CLK_SI5351_P, ADC_DATA_A[13..0], ADC_OR_A, ADC_SYNC, CS-ADC, CS-LF, LF, MOSI-LF, SCLK-ADC, SCLK-LF, SDATA-ADC

### Nets
1.8ADC: C34.1 C48.1 C50.1 C57.1 C58.1 C60.1 C62.1 C63.1 U6.49(AVDD) U6.50(AVDD) U6.53(AVDD) U6.54(AVDD) U6.59(AVDD) U6.60(AVDD) U6.63(AVDD) U6.64(AVDD)
3.3D: C64.1 C65.1 C69.1 C73.1 U6.10(DRVDD) U6.19(DRVDD) U6.28(DRVDD) U6.37(DRVDD)
GND: C34.2 C48.2 C49.2 C50.2 C57.2 C58.2 C60.2 C62.2 C63.2 C64.2 C65.2 C69.2 C73.2 C74.2 C75.2 C76.2 C79.2 C82.1 C83.1 C84.1 C92.2 C93.2 R20.1 R27.1 R29.1 R34.1 U6.0(EPAD) U9.2(IN_GND) U9.7(OUT_GND) U9.10(OUT_GND) U9.15(IN_GND)
VCC-IF: R70.1 R71.2
ADC_CLK_FPGA_N: C173.1 ; port ADC_CLK_FPGA_N
ADC_CLK_FPGA_P: C172.1 ; port ADC_CLK_FPGA_P
ADC_DATA_A0: U6.27(D0A)
ADC_DATA_A1: U6.29(D1A)
ADC_DATA_A2: U6.30(D2A)
ADC_DATA_A3: U6.31(D3A)
ADC_DATA_A4: U6.32(D4A)
ADC_DATA_A5: U6.33(D5A)
ADC_DATA_A6: U6.34(D6A)
ADC_DATA_A7: U6.35(D7A)
ADC_DATA_A8: U6.36(D8A)
ADC_DATA_A9: U6.38(D9A)
ADC_DATA_A10: U6.39(D10A)
ADC_DATA_A11: U6.40(D11A)
ADC_DATA_A12: U6.41(D12A)
ADC_DATA_A13: U6.42(D13A)
CS-ADC: R96.1 ; port CS-ADC
CS-LF: U9.12(LATCH) ; port CS-LF
LF_F_N: C89.1 R19.1 R58.1 R67.1 U6.52(VINA-)
LF_F_P: C89.2 R19.2 R39.2 R52.2 U6.51(VINA+)
LF_N: C85.1 C91.2 R54.2 R59.2
LF_P: C81.2 C85.2 R37.1 R41.1
MOSI-LF: U9.14(MOSI) ; port MOSI-LF
SCLK-ADC: R97.1 ; port SCLK-ADC
SCLK-LF: U9.13(SCLK) ; port SCLK-LF
SDATA-ADC: R98.1 ; port SDATA-ADC
VCCO: C79.1 R71.1 U9.6(VCC_OUT) U9.11(VCCOUT)
NetAnt6_1: C82.2 R35.1 R105.1 ; port LF
NetC49_1: C49.1 U12.5(B+)
NetC74_1: C74.1 U6.57(VCM)
NetC75_1: C75.1 C76.1 U6.55(VREF)
NetC80_1: C80.1 U12.1(A+)
NetC80_2: C80.2 R53.1 U9.16(IN-)
NetC81_1: C81.1 U9.9(OUT-)
NetC83_2: C83.2 R35.2 R36.1 R40.1 R105.2
NetC84_2: C84.2 R36.2 R40.2 U12.4(B-)
NetC86_1: C86.1 R54.1 R56.2 R59.1 R66.2
NetC86_2: C86.2 R37.2 R38.1 R41.2 R51.1
NetC87_1: C87.1 R56.1 R58.2 R66.1 R67.2
NetC87_2: C87.2 R38.2 R39.1 R51.2 R52.1
NetC90_1: C90.1 U12.3(A-)
NetC90_2: C90.2 R53.2 U9.1(IN+)
NetC91_1: C91.1 U9.8(OUT+)
NetC92_1: C92.1 R70.2 U9.3(VCC_IN) U9.4(PWR_UP)
NetC93_1: C93.1 U9.5(VOCM)
NetC170_1: C170.1 ; port ADC_CLK_SI5351_P
NetC170_2: C170.2 C172.2 R100.2
NetC171_1: C171.1 ; port ADC_CLK_SI5351_N
NetC171_2: C171.2 C173.2 R101.2
NetR20_2: R20.2 U6.47(OEB)
NetR26_1: R26.1 U6.62(VINB+)
NetR26_2: R26.2 U6.61(VINB-)
NetR27_2: R27.2 U6.48(PDWN)
NetR29_2: R29.2 U6.56(SENSE)
NetR34_2: R34.2 U6.58(RBIAS)
NetR96_2: R96.2 U6.46(CSB)
NetR97_2: R97.2 U6.45(SCLK/DFS)
NetR98_2: R98.2 U6.44(SDIO/DCS)
NetR99_1: R99.1 R100.1 U6.1(CLK+)
NetR99_2: R99.2 R101.1 U6.2(CLK-)
NetU1_A14: U6.43(ORA) ; port ADC_OR_A
NetU1_C9: U6.24(DCOA) ; port ADC_CLK_A
NetU6_3: U6.3(SYNC) ; port ADC_SYNC

Not connected (* = marked no-connect by the designer): U6 4(NC) 5(NC) 6(D0B) 7(D1B) 8(D2B) 9(D3B) 11(D4B) 12(D5B) 13(D6B) 14(D7B) 15(D8B) 16(D9B) 17(D10B) 18(D11B) 20(D12B) 21(D13B) 22(ORB) 23(DCOB) 25(NC) 26(NC); U12 2(C)

### Buses and harness runs
bus ADC_DATA_A[13..0] = port ADC_DATA_A[13..0]

### Layout directives
net class ADC Signals: ADC_DATA_A[13..0], CS-ADC, CS-LF, MOSI-LF, SCLK-ADC, SCLK-LF, SDATA-ADC

### Library data of the parts
C34 C48-C50 C57 C58 C60 C62-C65 C69 C73-C76 C79-C87 C89-C93 C170-C173 = CAP0402-CAP: as C39 on sheet mix1_LO1
R19 R20 R26 R27 R29 R34-R41 R51-R54 R56 R58 R59 R66 R67 R70 R71 R96-R101 R105 = Res2: Resistor; Value: 0Ohm; Published: 8-Jun-2000; LatestRevisionDate: 17-Jul-2002; LatestRevisionNote: Re-released for DXP Platform.; PackageReference: AXIAL-0.4; Publisher: Altium Limited; PackageDescription: Axial Device, Thru-Hole; 2 Leads; 0.4 in Pin Spacing
U12 = TCM-63AX+

## Sheet FPGA.SchDoc
size A3
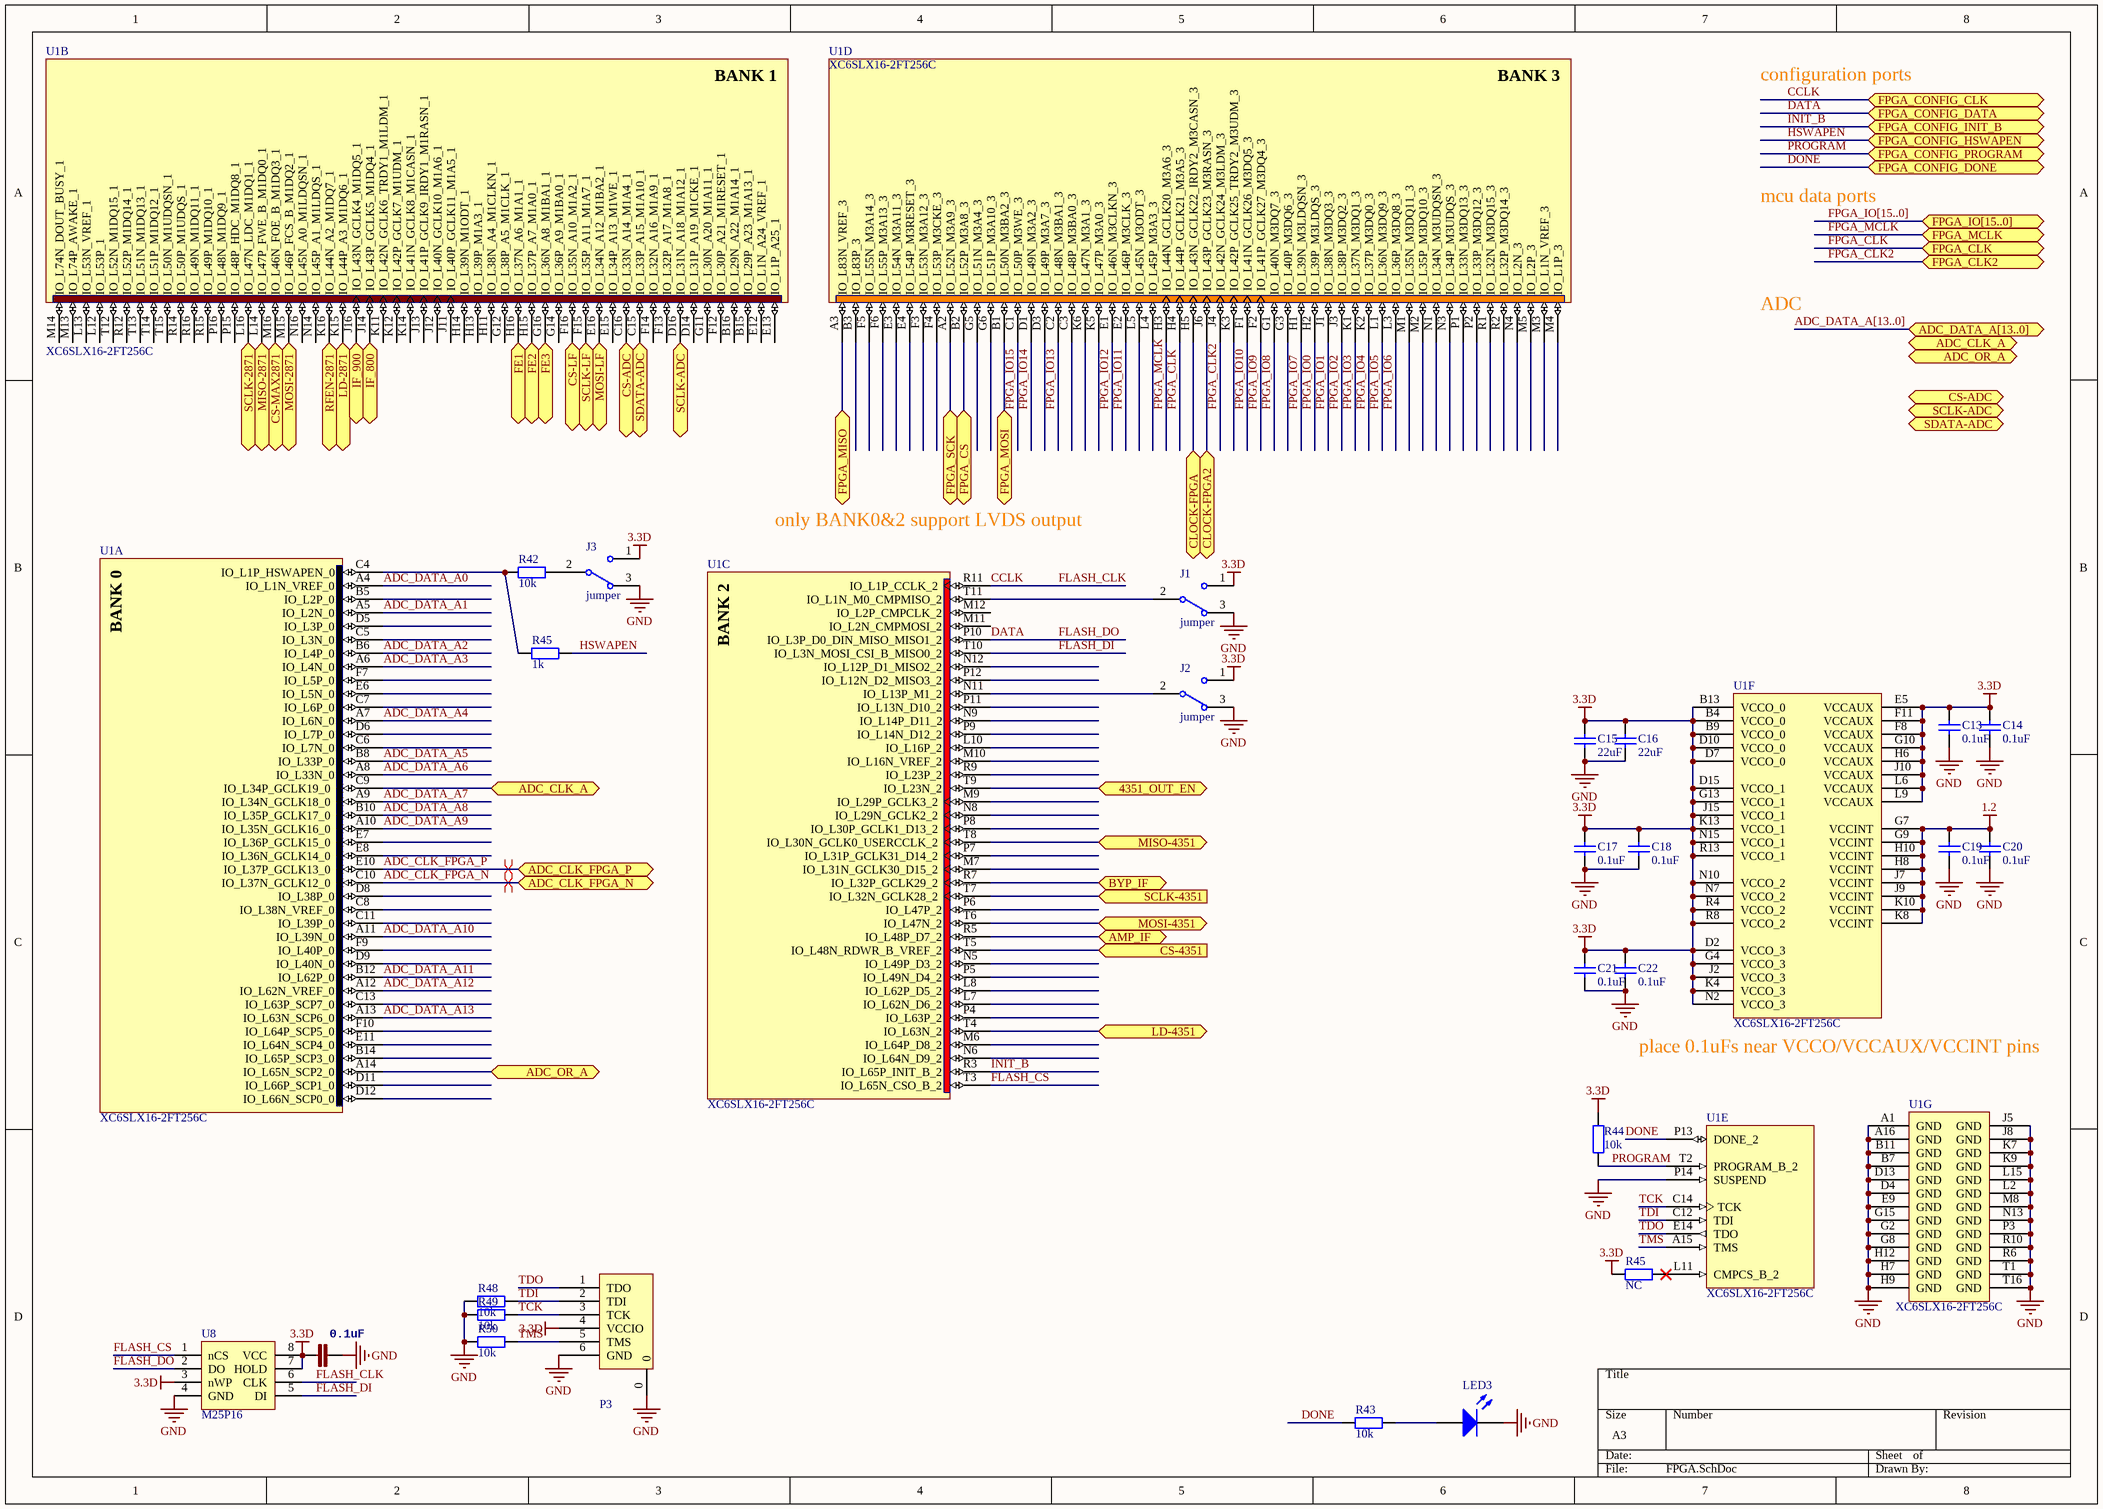
[diagram p4: FPGA.SchDoc]

### Parts
(Parts that share a designator on the sheet are numbered #1, #2 ... from top to bottom, then left to right.)
C13  0.1uF  [0402]
C14  0.1uF  [0402]
C15  value 22uF  [0805]  (hidden comment: Cap)
C16  value 22uF  [0805]  (hidden comment: Cap)
C17  0.1uF  [0402]
C18  0.1uF  [0402]
C19  0.1uF  [0402]
C20  0.1uF  [0402]
C21  0.1uF  [0402]
C22  0.1uF  [0402]
C68  0.1uF  [0402]
J1  jumper  [0402J]
J2  jumper  [0402J]
J3  jumper  [0402J]
LED3  LED0  [0603]  (value not drawn)
P3  JTAG-6P  [GH1.25-6]  (value not drawn)
R42  10k  [0402]
R43  10k  [0402]
R44  10k  [0402]
R45#1  1k  [0402]
R45#2  NC  [0402]
R48  10k  [0402]
R49  10k  [0402]
R50  10k  [0402]
U1  XC6SLX16-2FT256C  [FT256]  (parts A,B,C,D,E,F,G of 7)
U8  M25P16  [SO8]

### Ports
4351_OUT_EN, ADC_CLK_A, ADC_CLK_FPGA_N, ADC_CLK_FPGA_P, ADC_DATA_A[13..0], ADC_OR_A, AMP_IF, BYP_IF, CLOCK-FPGA, CLOCK-FPGA2, CS-4351 (in), CS-ADC, CS-LF, CS-MAX2871 (in), FE1, FE2, FE3, FPGA_CLK, FPGA_CLK2, FPGA_CONFIG_CLK, FPGA_CONFIG_DATA, FPGA_CONFIG_DONE, FPGA_CONFIG_HSWAPEN, FPGA_CONFIG_INIT_B, FPGA_CONFIG_PROGRAM, FPGA_CS, FPGA_IO[15..0], FPGA_MCLK, FPGA_MISO, FPGA_MOSI, FPGA_SCK, IF_800, IF_900, LD-2871, LD-4351, MISO-2871, MISO-4351, MOSI-2871, MOSI-4351, MOSI-LF, RFEN-2871, SCLK-2871 (in), SCLK-4351 (in), SCLK-ADC, SCLK-LF, SDATA-ADC

### Nets
1.2: C19.1 C20.1 U1.G7(VCCINT) U1.G9(VCCINT) U1.H8(VCCINT) U1.H10(VCCINT) U1.J7(VCCINT) U1.J9(VCCINT) U1.K8(VCCINT) U1.K10(VCCINT)
3.3D: C13.1 C14.1 C15.2 C16.2 C17.1 C18.1 C21.1 C22.1 C68.2 J1.1 J2.1 J3.1 P3.4(VCCIO) R44.1 R45#2.2 U1.B4(VCCO_0) U1.B9(VCCO_0) U1.B13(VCCO_0) U1.D2(VCCO_3) U1.D7(VCCO_0) U1.D10(VCCO_0) U1.D15(VCCO_1) U1.E5(VCCAUX) U1.F8(VCCAUX) U1.F11(VCCAUX) U1.G4(VCCO_3) U1.G10(VCCAUX) U1.G13(VCCO_1) U1.H6(VCCAUX) U1.J2(VCCO_3) U1.J10(VCCAUX) U1.J15(VCCO_1) U1.K4(VCCO_3) U1.K13(VCCO_1) U1.L6(VCCAUX) U1.L9(VCCAUX) U1.N2(VCCO_3) U1.N7(VCCO_2) U1.N10(VCCO_2) U1.N15(VCCO_1) U1.R4(VCCO_2) U1.R8(VCCO_2) U1.R13(VCCO_1) U8.3(nWP) U8.7(HOLD) U8.8(VCC)
GND: C13.2 C14.2 C15.1 C16.1 C17.2 C18.2 C19.2 C20.2 C21.2 C22.2 C68.1 J1.3 J2.3 J3.3 LED3.2(K) P3.0 P3.6(GND) R48.2 R49.2 R50.2 U1.A1(GND) U1.A16(GND) U1.B7(GND) U1.B11(GND) U1.D4(GND) U1.D13(GND) U1.E9(GND) U1.G2(GND) U1.G8(GND) U1.G15(GND) U1.H7(GND) U1.H9(GND) U1.H12(GND) U1.J5(GND) U1.J8(GND) U1.K7(GND) U1.K9(GND) U1.L2(GND) U1.L15(GND) U1.M8(GND) U1.N13(GND) U1.P3(GND) U1.P14(SUSPEND) U1.R6(GND) U1.R10(GND) U1.T1(GND) U1.T16(GND) U8.4(GND)
ADC_CLK_FPGA_N: U1.C10(IO_L37N_GCLK12_0) ; port ADC_CLK_FPGA_N
ADC_CLK_FPGA_P: U1.E10(IO_L37P_GCLK13_0) ; port ADC_CLK_FPGA_P
ADC_DATA_A0: U1.A4(IO_L1N_VREF_0)
ADC_DATA_A1: U1.A5(IO_L2N_0)
ADC_DATA_A2: U1.B6(IO_L4P_0)
ADC_DATA_A3: U1.A6(IO_L4N_0)
ADC_DATA_A4: U1.A7(IO_L6N_0)
ADC_DATA_A5: U1.B8(IO_L33P_0)
ADC_DATA_A6: U1.A8(IO_L33N_0)
ADC_DATA_A7: U1.A9(IO_L34N_GCLK18_0)
ADC_DATA_A8: U1.B10(IO_L35P_GCLK17_0)
ADC_DATA_A9: U1.A10(IO_L35N_GCLK16_0)
ADC_DATA_A10: U1.A11(IO_L39N_0)
ADC_DATA_A11: U1.B12(IO_L62P_0)
ADC_DATA_A12: U1.A12(IO_L62N_VREF_0)
ADC_DATA_A13: U1.A13(IO_L63N_SCP6_0)
AMP_IF: U1.R5(IO_L48P_D7_2) ; port AMP_IF
BYP_IF: U1.R7(IO_L32P_GCLK29_2) ; port BYP_IF
CCLK: U1.R11(IO_L1P_CCLK_2) U8.6(CLK) ; port FPGA_CONFIG_CLK  [also labelled FLASH_CLK]
CS-ADC: U1.C16(IO_L33N_A14_M1A4_1) ; port CS-ADC
CS-LF: U1.F16(IO_L35N_A10_M1A2_1) ; port CS-LF
CS-MAX2871: U1.M16(IO_L46N_FOE_B_M1DQ3_1) ; port CS-MAX2871
DATA: U1.P10(IO_L3P_D0_DIN_MISO_MISO1_2) U8.2(DO) ; port FPGA_CONFIG_DATA  [also labelled FLASH_DO]
DONE: R43.1 U1.P13(DONE_2) ; port FPGA_CONFIG_DONE
FE1: U1.H16(IO_L37N_A6_M1A1_1) ; port FE1
FE2: U1.H15(IO_L37P_A7_M1A0_1) ; port FE2
FE3: U1.G16(IO_L36N_A8_M1BA1_1) ; port FE3
FLASH_CS: U1.T3(IO_L65N_CSO_B_2) U8.1(nCS)
FLASH_DI: U1.T10(IO_L3N_MOSI_CSI_B_MISO0_2) U8.5(DI)
FPGA_CLK: U1.H4(IO_L44P_GCLK21_M3A5_3) ; port FPGA_CLK
FPGA_CLK2: U1.J4(IO_L42N_GCLK24_M3LDM_3) ; port FPGA_CLK2
FPGA_IO0: U1.H2(IO_L39P_M3LDQS_3)
FPGA_IO1: U1.J1(IO_L38N_M3DQ3_3)
FPGA_IO2: U1.J3(IO_L38P_M3DQ2_3)
FPGA_IO3: U1.K1(IO_L37N_M3DQ1_3)
FPGA_IO4: U1.K2(IO_L37P_M3DQ0_3)
FPGA_IO5: U1.L1(IO_L36N_M3DQ9_3)
FPGA_IO6: U1.L3(IO_L36P_M3DQ8_3)
FPGA_IO7: U1.H1(IO_L39N_M3LDQSN_3)
FPGA_IO8: U1.G1(IO_L40N_M3DQ7_3)
FPGA_IO9: U1.F2(IO_L41P_GCLK27_M3DQ4_3)
FPGA_IO10: U1.F1(IO_L41N_GCLK26_M3DQ5_3)
FPGA_IO11: U1.E2(IO_L46P_M3CLK_3)
FPGA_IO12: U1.E1(IO_L46N_M3CLKN_3)
FPGA_IO13: U1.C2(IO_L48N_M3BA1_3)
FPGA_IO14: U1.D1(IO_L49N_M3A2_3)
FPGA_IO15: U1.C1(IO_L50P_M3WE_3)
FPGA_MCLK: U1.H3(IO_L44N_GCLK20_M3A6_3) ; port FPGA_MCLK
HSWAPEN: R45#1.1 ; port FPGA_CONFIG_HSWAPEN
IF_800: U1.J14(IO_L43P_GCLK5_M1DQ4_1) ; port IF_800
IF_900: U1.J16(IO_L43N_GCLK4_M1DQ5_1) ; port IF_900
INIT_B: U1.R3(IO_L65P_INIT_B_2) ; port FPGA_CONFIG_INIT_B
LD-2871: U1.K15(IO_L44P_A3_M1DQ6_1) ; port LD-2871
MISO-2871: U1.L14(IO_L47P_FWE_B_M1DQ0_1) ; port MISO-2871
MOSI-2871: U1.M15(IO_L46P_FCS_B_M1DQ2_1) ; port MOSI-2871
MOSI-LF: U1.E16(IO_L34N_A12_M1BA2_1) ; port MOSI-LF
PC10: U1.A2(IO_L52N_M3A9_3) ; port FPGA_SCK
PC11: U1.A3(IO_L83N_VREF_3) ; port FPGA_MISO
PC12: U1.B1(IO_L50N_M3BA2_3) ; port FPGA_MOSI
PROGRAM: R44.2 U1.T2(PROGRAM_B_2) ; port FPGA_CONFIG_PROGRAM
RFEN-2871: U1.K16(IO_L44N_A2_M1DQ7_1) ; port RFEN-2871
SCLK-2871: U1.L16(IO_L47N_LDC_M1DQ1_1) ; port SCLK-2871
SCLK-ADC: U1.D16(IO_L31N_A18_M1A12_1) ; port SCLK-ADC
SCLK-LF: U1.F15(IO_L35P_A11_M1A7_1) ; port SCLK-LF
SDATA-ADC: U1.C15(IO_L33P_A15_M1A10_1) ; port SDATA-ADC
TCK: P3.3(TCK) R49.1 U1.C14(TCK)
TDI: P3.2(TDI) R48.1 U1.C12(TDI)
TDO: P3.1(TDO) U1.E14(TDO)
TMS: P3.5(TMS) R50.1 U1.A15(TMS)
NetJ1_2: J1.2 U1.T11(IO_L1N_M0_CMPMISO_2)
NetJ2_2: J2.2 U1.N11(IO_L13P_M1_2)
NetJ3_2: J3.2 R42.1
NetLED3_1: LED3.1(A) R43.2
NetR42_2: R42.2 R45#1.2 U1.C4(IO_L1P_HSWAPEN_0)
NetR45#2_1: R45#2.1 U1.L11(CMPCS_B_2)
NetR118_2: U1.T7(IO_L32N_GCLK28_2) ; port SCLK-4351
NetR119_2: U1.T6(IO_L47N_2) ; port MOSI-4351
NetR120_2: U1.T5(IO_L48N_RDWR_B_VREF_2) ; port CS-4351
NetR121_2: U1.T8(IO_L30N_GCLK0_USERCCLK_2) ; port MISO-4351
NetR122_2: U1.T9(IO_L23N_2) ; port 4351_OUT_EN
NetR123_2: U1.T4(IO_L63N_2) ; port LD-4351
NetU1_A14: U1.A14(IO_L65N_SCP2_0) ; port ADC_OR_A
NetU1_B2: U1.B2(IO_L52P_M3A8_3) ; port FPGA_CS
NetU1_C9: U1.C9(IO_L34P_GCLK19_0) ; port ADC_CLK_A
NetU1_H5: U1.H5(IO_L43N_GCLK22_IRDY2_M3CASN_3) ; port CLOCK-FPGA
NetU1_J6: U1.J6(IO_L43P_GCLK23_M3RASN_3) ; port CLOCK-FPGA2

Not connected (* = marked no-connect by the designer): U1 B3(IO_L83P_3) B5(IO_L2P_0) B14(IO_L65P_SCP3_0) B15(IO_L29P_A23_M1A13_1) B16(IO_L29N_A22_M1A14_1) C3(IO_L48P_M3BA0_3) C5(IO_L3N_0) C6(IO_L7N_0) C7(IO_L6P_0) C8(IO_L38N_VREF_0) C11(IO_L39P_0) C13(IO_L63P_SCP7_0) D3(IO_L49P_M3A7_3) D5(IO_L3P_0) D6(IO_L7P_0) D8(IO_L38P_0) D9(IO_L40N_0) D11(IO_L66P_SCP1_0) D12(IO_L66N_SCP0_0) D14(IO_L31P_A19_M1CKE_1) E3(IO_L54N_M3A11_3) E4(IO_L54P_M3RESET_3) E6(IO_L5N_0) E7(IO_L36P_GCLK15_0) E8(IO_L36N_GCLK14_0) E11(IO_L64N_SCP4_0) E12(IO_L1N_A24_VREF_1) E13(IO_L1P_A25_1) E15(IO_L34P_A13_M1WE_1) F3(IO_L53N_M3A12_3) F4(IO_L53P_M3CKE_3) F5(IO_L55N_M3A14_3) F6(IO_L55P_M3A13_3) F7(IO_L5P_0) F9(IO_L40P_0) F10(IO_L64P_SCP5_0) F12(IO_L30P_A21_M1RESET_1) F13(IO_L32P_A17_M1A8_1) F14(IO_L32N_A16_M1A9_1) G3(IO_L40P_M3DQ6_3) G5(IO_L51N_M3A4_3) G6(IO_L51P_M3A10_3) G11(IO_L30N_A20_M1A11_1) G12(IO_L38P_A5_M1CLK_1) G14(IO_L36P_A9_M1BA0_1) H11(IO_L38N_A4_M1CLKN_1) H13(IO_L39P_M1A3_1) H14(IO_L39N_M1ODT_1) J11(IO_L40P_GCLK11_M1A5_1) J12(IO_L40N_GCLK10_M1A6_1) J13(IO_L41P_GCLK9_IRDY1_M1RASN_1) K3(IO_L42P_GCLK25_TRDY2_M3UDM_3) K5(IO_L47P_M3A0_3) K6(IO_L47N_M3A1_3) K11(IO_L42N_GCLK6_TRDY1_M1LDM_1) K12(IO_L42P_GCLK7_M1UDM_1) K14(IO_L41N_GCLK8_M1CASN_1) L4(IO_L45P_M3A3_3) L5(IO_L45N_M3ODT_3) L7(IO_L62N_D6_2) L8(IO_L62P_D5_2) L10(IO_L16P_2) L12(IO_L53P_1) L13(IO_L53N_VREF_1) M1(IO_L35N_M3DQ11_3) M2(IO_L35P_M3DQ10_3) M3(IO_L1N_VREF_3) M4(IO_L1P_3) M5(IO_L2P_3) M6(IO_L64P_D8_2) M7(IO_L31N_GCLK30_D15_2) M9(IO_L29P_GCLK3_2) M10(IO_L16N_VREF_2) M11(IO_L2N_CMPMOSI_2) M12(IO_L2P_CMPCLK_2) M13(IO_L74P_AWAKE_1) M14(IO_L74N_DOUT_BUSY_1) N1(IO_L34N_M3UDQSN_3) N3(IO_L34P_M3UDQS_3) N4(IO_L2N_3) N5(IO_L49P_D3_2) N6(IO_L64N_D9_2) N8(IO_L29N_GCLK2_2) N9(IO_L14P_D11_2) N12(IO_L12P_D1_MISO2_2) N14(IO_L45P_A1_M1LDQS_1) N16(IO_L45N_A0_M1LDQSN_1) P1(IO_L33N_M3DQ13_3) P2(IO_L33P_M3DQ12_3) P4(IO_L63P_2) P5(IO_L49N_D4_2) P6(IO_L47P_2) P7(IO_L31P_GCLK31_D14_2) P8(IO_L30P_GCLK1_D13_2) P9(IO_L14N_D12_2) P11(IO_L13N_D10_2) P12(IO_L12N_D2_MISO3_2) P15(IO_L48P_HDC_M1DQ8_1) P16(IO_L48N_M1DQ9_1) R1(IO_L32N_M3DQ15_3) R2(IO_L32P_M3DQ14_3) R9(IO_L23P_2) R12(IO_L52P_M1DQ14_1) R14(IO_L50P_M1UDQS_1) R15(IO_L49P_M1DQ10_1) R16(IO_L49N_M1DQ11_1) T12(IO_L52N_M1DQ15_1) T13(IO_L51N_M1DQ13_1) T14(IO_L51P_M1DQ12_1) T15(IO_L50N_M1UDQSN_1)

### Buses and harness runs
bus ADC_DATA_A[13..0] = port ADC_DATA_A[13..0]
bus FPGA_IO[15..0] = port FPGA_IO[15..0]

### Layout directives
differential pair: ADC_CLK_FPGA_N, ADC_CLK_FPGA_P

### Notes on the sheet
- configuration ports
- mcu data ports
- ADC
- only BANK0&2 support LVDS output
- (near U1) place 0.1uFs near VCCO/VCCAUX/VCCINT pins
- (in symbol XC6SLX16-2FT256C, part A) BANK 0
- (in symbol XC6SLX16-2FT256C, part B) BANK 1
- (in symbol XC6SLX16-2FT256C, part C) BANK 2
- (in symbol XC6SLX16-2FT256C, part D) BANK 3

### Library data of the parts
C13-C22 = Cap: Capacitor; Published: 8-Jun-2000; LatestRevisionDate: 17-Jul-2002; LatestRevisionNote: Re-released for DXP Platform.; PackageReference: RAD-0.3; Publisher: Altium Limited; PackageDescription: Radial Cap, Thru-Hole; 2 Leads; 0.3 in Pin Spacing
C68 = CAP0402-CAP: as C39 on sheet mix1_LO1
J1-J3 = SW-SPDT: SPDT Subminiature Toggle Switch, Right Angle Mounting, Vertical Actuation; Published: 24-Mar-1999; LatestRevisionDate: 17-Dec-2003; LatestRevisionNote: Schematic revised, PCB Footprint replaced.; DatasheetVersion: 05-Dec-2000; PackageReference: TL36WW15050; Publisher: Altium Limited; PackageDescription: Switch; 4 Leads; ComponentLink1Description: Manufacturer Link; ComponentLink1URL: http://www.apem.com
LED3 = LED0: Typical INFRARED GaAs LED; Published: 8-Jun-2000; LatestRevisionDate: 08-Jul-2005; LatestRevisionNote: Mech Layer 1 removed.; PackageReference: LED-0; Publisher: Altium Limited; PackageDescription: LED; 2 Leads
R42-R44 R45#1 R45#2 R48-R50 = Res2: Resistor; Published: 8-Jun-2000; LatestRevisionDate: 17-Jul-2002; LatestRevisionNote: Re-released for DXP Platform.; PackageReference: AXIAL-0.4; Publisher: Altium Limited; PackageDescription: Axial Device, Thru-Hole; 2 Leads; 0.4 in Pin Spacing
U1 = XC6SLX16-2FT256C: Spartan-6 LX 1.2V FPGA, 186 User I/Os, 256-Ball Fine-Pitch Thin BGA (1.0mm Pitch), Speed Grade 2, Commercial Grade; Published: 17-Nov-2009; DatasheetVersion: ver1.6, Nov-2010; PackageVersion: ver1.3, Oct-2007; PackageReference: FT256; Publisher: Altium Limited; PackageDescription: 256-Ball Fine Pitch Thin Ball Grid Array 1.00 mm Pitch (FT256); Code_JEDEC: MS-034-AAF-1*; ComponentLink1Description: Manufacturer Link; ComponentLink1URL: http://www.xilinx.com; ComponentLink2Description: Spartan-6 Datasheet; ComponentLink2URL: http://www.xilinx.com/support/documentation/data_sheets/ds160.pdf; ComponentLink3Description: Spartan-6 Documents; ComponentLink3URL: http://www.xilinx.com/support/documentation/spartan-6.htm; ComponentLink4Description: Xilinx.com Home; ComponentLink4URL: http://www.xilinx.com

## Sheet mcu.SchDoc
size A3
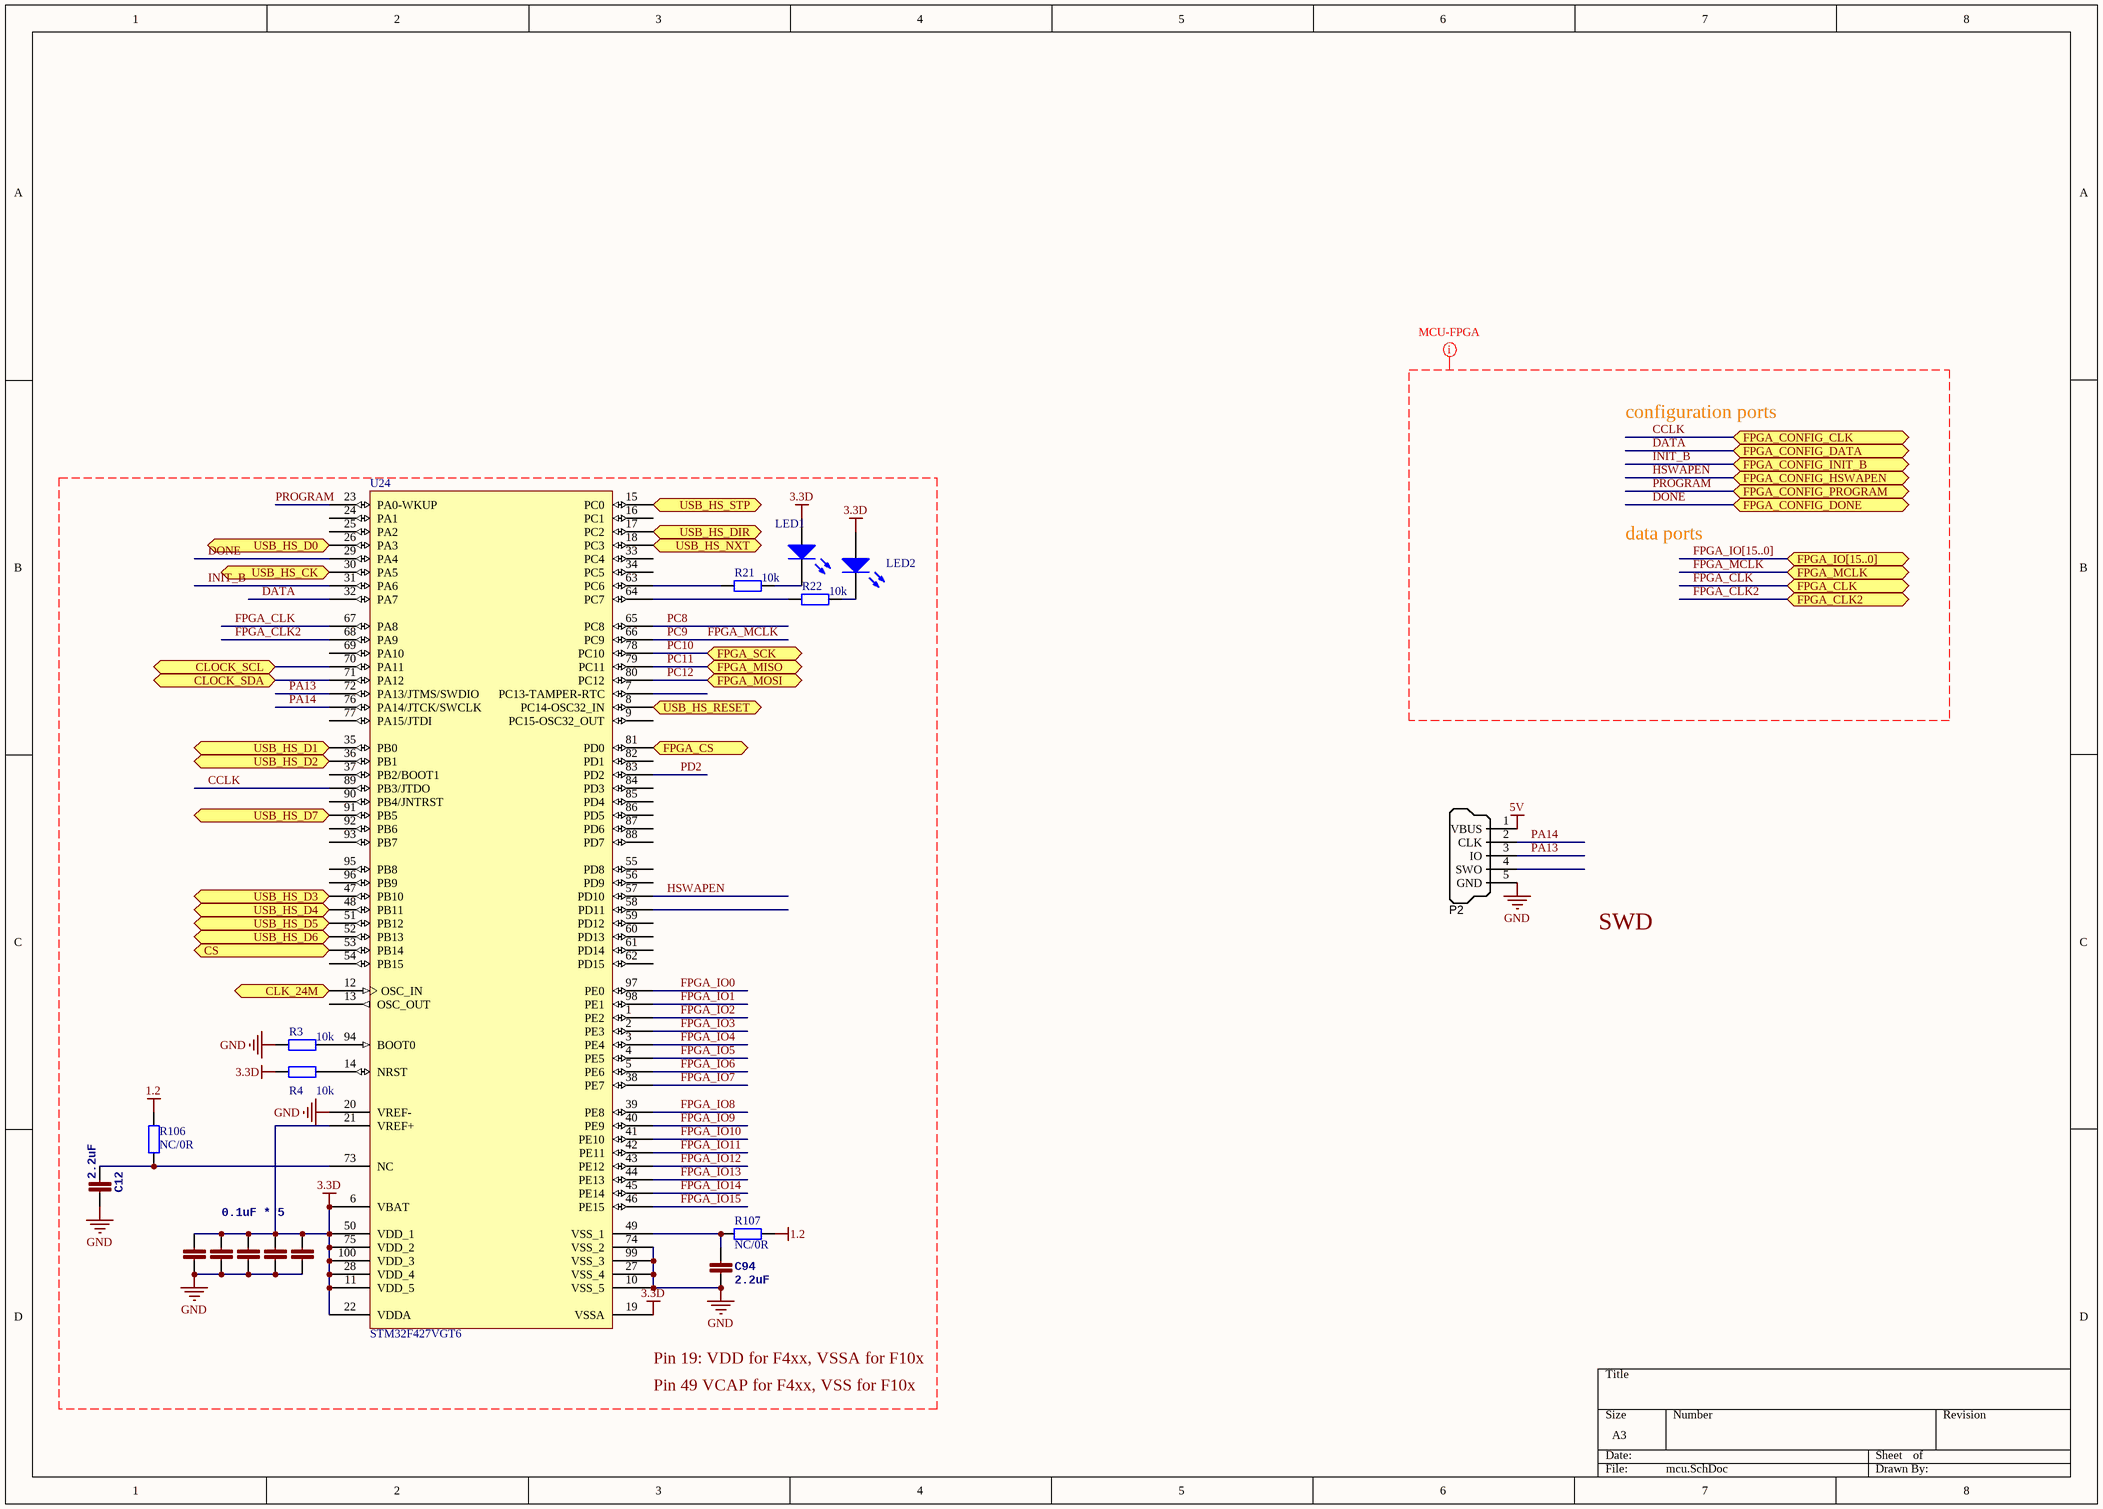
[diagram p5: mcu.SchDoc]

### Parts
C4  0.1uF * 5  [0402]
C5  1n  [0402]  (value not drawn)
C6  1n  [0402]  (value not drawn)
C10  1n  [0402]  (value not drawn)
C12  2.2uF  [0603]
C25  1n  [0402]  (value not drawn)
C94  2.2uF  [0603]
LED1  LED0  [0603]  (value not drawn)
LED2  LED0  [0603]  (value not drawn)
P2  SWD_MicroUSB  [MICRO-YZX]  (value not drawn)
R3  10k  [0402]
R4  10k  [0402]
R21  10k  [0402]
R22  10k  [0402]
R106  NC/0R  [0402]
R107  NC/0R  [0402]
U24  STM32F427VGT6  [LQFP100_N]

### Ports
CLK_24M, CLOCK_SCL, CLOCK_SDA, CS, FPGA_CLK, FPGA_CLK2, FPGA_CONFIG_CLK, FPGA_CONFIG_DATA, FPGA_CONFIG_DONE, FPGA_CONFIG_HSWAPEN, FPGA_CONFIG_INIT_B, FPGA_CONFIG_PROGRAM, FPGA_CS, FPGA_IO[15..0], FPGA_MCLK, FPGA_MISO, FPGA_MOSI, FPGA_SCK, USB_HS_CK, USB_HS_D0, USB_HS_D1, USB_HS_D2, USB_HS_D3, USB_HS_D4, USB_HS_D5, USB_HS_D6, USB_HS_D7, USB_HS_DIR, USB_HS_NXT, USB_HS_RESET, USB_HS_STP

### Nets
1.2: R106.1 R107.1
3.3D: C4.2 C5.2 C6.2 C10.2 C25.2 LED1.1(A) LED2.1(A) R4.2 U24.6(VBAT) U24.11(VDD_5) U24.19(VSSA) U24.21(VREF+) U24.22(VDDA) U24.28(VDD_4) U24.50(VDD_1) U24.75(VDD_2) U24.100(VDD_3)
5V: P2.1(VBUS)
GND: C4.1 C5.1 C6.1 C10.1 C12.1 C25.1 C94.1 P2.5(GND) R3.1 U24.10(VSS_5) U24.20(VREF-) U24.27(VSS_4) U24.74(VSS_2) U24.99(VSS_3)
CCLK: U24.89(PB3/JTDO) ; port FPGA_CONFIG_CLK
DATA: U24.32(PA7) ; port FPGA_CONFIG_DATA
DONE: U24.29(PA4) ; port FPGA_CONFIG_DONE
FPGA_CLK: U24.67(PA8) ; port FPGA_CLK
FPGA_CLK2: U24.68(PA9) ; port FPGA_CLK2
FPGA_IO0: U24.97(PE0)
FPGA_IO1: U24.98(PE1)
FPGA_IO2: U24.1(PE2)
FPGA_IO3: U24.2(PE3)
FPGA_IO4: U24.3(PE4)
FPGA_IO5: U24.4(PE5)
FPGA_IO6: U24.5(PE6)
FPGA_IO7: U24.38(PE7)
FPGA_IO8: U24.39(PE8)
FPGA_IO9: U24.40(PE9)
FPGA_IO10: U24.41(PE10)
FPGA_IO11: U24.42(PE11)
FPGA_IO12: U24.43(PE12)
FPGA_IO13: U24.44(PE13)
FPGA_IO14: U24.45(PE14)
FPGA_IO15: U24.46(PE15)
FPGA_MCLK: U24.66(PC9) ; port FPGA_MCLK  [also labelled PC9]
HSWAPEN: U24.57(PD10) ; port FPGA_CONFIG_HSWAPEN
INIT_B: U24.31(PA6) ; port FPGA_CONFIG_INIT_B
PA13: P2.3(IO) U24.72(PA13/JTMS/SWDIO)
PA14: P2.2(CLK) U24.76(PA14/JTCK/SWCLK)
PC8: U24.65(PC8)
PC10: U24.78(PC10) ; port FPGA_SCK
PC11: U24.79(PC11) ; port FPGA_MISO
PC12: U24.80(PC12) ; port FPGA_MOSI
PD2: U24.83(PD2)
PROGRAM: U24.23(PA0-WKUP) ; port FPGA_CONFIG_PROGRAM
USB_HS_CK: U24.30(PA5) ; port USB_HS_CK
USB_HS_DIR: U24.17(PC2) ; port USB_HS_DIR
USB_HS_NXT: U24.18(PC3) ; port USB_HS_NXT
USB_HS_RESET: U24.8(PC14-OSC32_IN) ; port USB_HS_RESET
USB_HS_STP: U24.15(PC0) ; port USB_HS_STP
NetC12_2: C12.2 R106.2 U24.73(NC)
NetC94_2: C94.2 R107.2 U24.49(VSS_1)
NetC108_2: U24.12(OSC_IN) ; port CLK_24M
NetLED1_2: LED1.2(K) R21.2
NetLED2_2: LED2.2(K) R22.2
NetR3_2: R3.2 U24.94(BOOT0)
NetR4_1: R4.1 U24.14(NRST)
NetR5_2: U24.71(PA12) ; port CLOCK_SDA
NetR6_2: U24.70(PA11) ; port CLOCK_SCL
NetR21_1: R21.1 U24.63(PC6)
NetR22_1: R22.1 U24.64(PC7)
NetU1_B2: U24.81(PD0) ; port FPGA_CS
NetU24_26: U24.26(PA3) ; port USB_HS_D0
NetU24_35: U24.35(PB0) ; port USB_HS_D1
NetU24_36: U24.36(PB1) ; port USB_HS_D2
NetU24_47: U24.47(PB10) ; port USB_HS_D3
NetU24_48: U24.48(PB11) ; port USB_HS_D4
NetU24_51: U24.51(PB12) ; port USB_HS_D5
NetU24_52: U24.52(PB13) ; port USB_HS_D6
NetU24_53: U24.53(PB14) ; port CS
NetU24_91: U24.91(PB5) ; port USB_HS_D7

Not connected (* = marked no-connect by the designer): P2 4(SWO); U24 7(PC13-TAMPER-RTC) 9(PC15-OSC32_OUT) 13(OSC_OUT) 16(PC1) 24(PA1) 25(PA2) 33(PC4) 34(PC5) 37(PB2/BOOT1) 54(PB15) 55(PD8) 56(PD9) 58(PD11) 59(PD12) 60(PD13) 61(PD14) 62(PD15) 69(PA10) 77(PA15/JTDI) 82(PD1) 84(PD3) 85(PD4) 86(PD5) 87(PD6) 88(PD7) 90(PB4/JNTRST) 92(PB6) 93(PB7) 95(PB8) 96(PB9)

### Buses and harness runs
bus FPGA_IO[15..0] = port FPGA_IO[15..0]

### Layout directives
net class MCU-FPGA: CCLK, DATA, DONE, FPGA_CLK, FPGA_CLK2, FPGA_IO[15..0], FPGA_MCLK, HSWAPEN, INIT_B, PROGRAM

### Notes on the sheet
- configuration ports
- data ports
- SWD
- Pin 19: VDD for F4xx, VSSA for F10x
- Pin 49 VCAP for F4xx, VSS for F10x

### Library data of the parts
C4-C6 C10 C12 C25 C94 = CAP0402-CAP: as C39 on sheet mix1_LO1
LED1 LED2 = LED0: Typical INFRARED GaAs LED; Published: 8-Jun-2000; LatestRevisionDate: 08-Jul-2005; LatestRevisionNote: Mech Layer 1 removed.; PackageReference: LED-0; Publisher: Altium Limited; PackageDescription: LED; 2 Leads
P2 = SWD_MicroUSB: Connector SMD USB Micro Type B middle mount; Manufacturer 1: Molex Inc; SCDType: undef; Package / Case: SMD; Supplier 1: Digi-Key; Supplier Part Number 1: WM17142CT-ND
R3 R4 R21 R22 R106 R107 = Res2: Resistor; Value: 0Ohm; Published: 8-Jun-2000; LatestRevisionDate: 17-Jul-2002; LatestRevisionNote: Re-released for DXP Platform.; PackageReference: AXIAL-0.4; Publisher: Altium Limited; PackageDescription: Axial Device, Thru-Hole; 2 Leads; 0.4 in Pin Spacing
U24 = STM32F103VBT6: STM32 ARM-based 32-bit MCU with 64 Kbytes Flash, 100-pin LQFP, Industrial Temperature; Published: *; DatasheetVersion: *; PackageVersion: *; PackageReference: *; Publisher: *; PackageDescription: *; ComponentLink1Description: *; ComponentLink1URL: *; ComponentLink2Description: *; ComponentLink2URL: *

## Sheet USB_HS_PHY.SchDoc
size A4
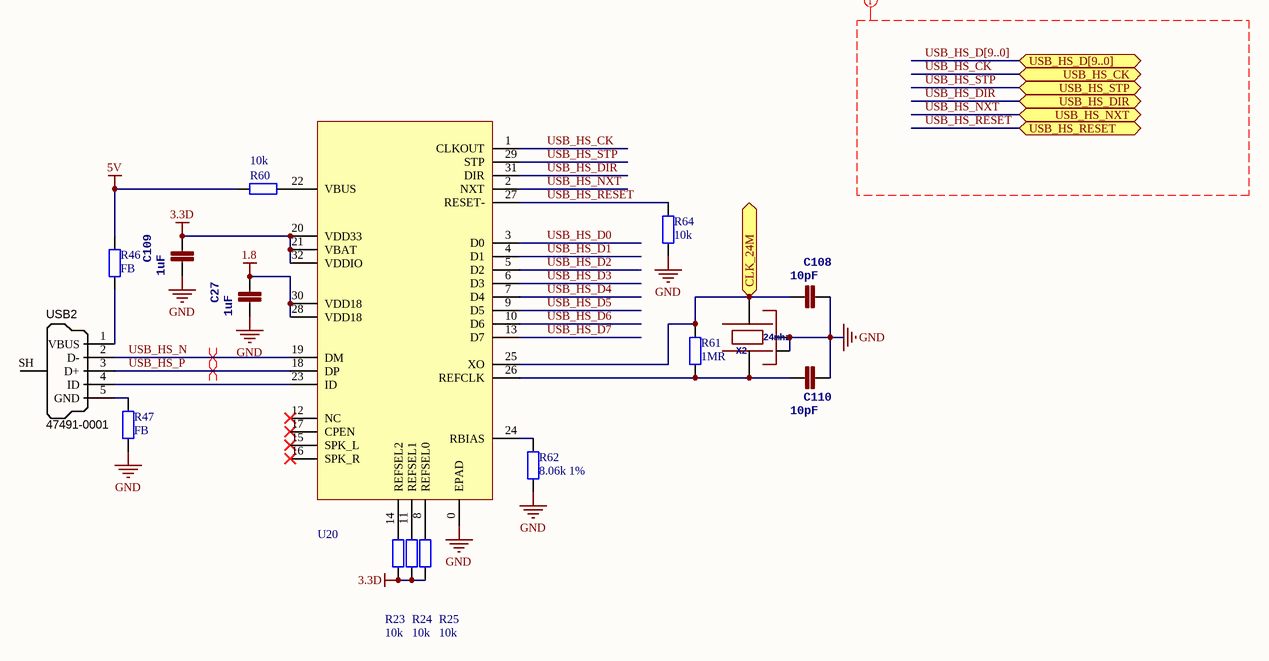
[diagram p6: USB_HS_PHY.SchDoc]

### Parts
C27  1uF  [0402]
C108  10pF  [0402]
C109  1uF  [0402]
C110  10pF  [0402]
R23  10k  [0402]
R24  10k  [0402]
R25  10k  [0402]
R46  FB  [0603]
R47  FB  [0603]
R60  10k  [0402]
R61  1MR  [0402]
R62  8.06k 1%  [0402]
R64  10k  [0402]
U20  USB3320  [USB3300]  (value not drawn)
USB2  Manufacturer Part Number 1: 47491-0001  [MICRO-YZX]  (hidden comment: USB Micro Type B)
X2  24mhz  [OSCILLATOR-3.2X2.5]

### Ports
CLK_24M, USB_HS_CK, USB_HS_D[9..0], USB_HS_DIR, USB_HS_NXT, USB_HS_RESET, USB_HS_STP

### Nets
1.8: C27.1 U20.28(VDD18) U20.30(VDD18)
3.3D: C109.1 R23.2 R24.2 R25.2 U20.20(VDD33) U20.21(VBAT) U20.32(VDDIO)
5V: R46.1 R60.1
GND: C27.2 C108.1 C109.2 C110.1 R47.2 R62.1 R64.2 U20.0(EPAD) X2.2(NC_2) X2.4(NC_4)
USB_HS_CK: U20.1(CLKOUT) ; port USB_HS_CK
USB_HS_D0: U20.3(D0)
USB_HS_D1: U20.4(D1)
USB_HS_D2: U20.5(D2)
USB_HS_D3: U20.6(D3)
USB_HS_D4: U20.7(D4)
USB_HS_D5: U20.9(D5)
USB_HS_D6: U20.10(D6)
USB_HS_D7: U20.13(D7)
USB_HS_DIR: U20.31(DIR) ; port USB_HS_DIR
USB_HS_N: U20.19(DM) USB2.2(D-)
USB_HS_NXT: U20.2(NXT) ; port USB_HS_NXT
USB_HS_P: U20.18(DP) USB2.3(D+)
USB_HS_RESET: R64.1 U20.27(RESET-) ; port USB_HS_RESET
USB_HS_STP: U20.29(STP) ; port USB_HS_STP
NetC108_2: C108.2 R61.2 U20.25(XO) X2.3 ; port CLK_24M
NetC110_2: C110.2 R61.1 U20.26(REFCLK) X2.1
NetR23_1: R23.1 U20.14(REFSEL2)
NetR24_1: R24.1 U20.11(REFSEL1)
NetR25_1: R25.1 U20.8(REFSEL0)
NetR46_2: R46.2 USB2.1(VBUS)
NetR47_1: R47.1 USB2.5(GND)
NetR60_2: R60.2 U20.22(VBUS)
NetR62_2: R62.2 U20.24(RBIAS)
NetU20_23: U20.23(ID) USB2.4(ID)

Not connected (* = marked no-connect by the designer): U20 12(NC)* 15(SPK_L)* 16(SPK_R)* 17(CPEN)*; USB2 SH(Shell)

### Buses and harness runs
bus USB_HS_D[9..0] = port USB_HS_D[9..0]

### Layout directives
differential pair: USB_HS_N, USB_HS_P
net class USB-HS: USB_HS_CK, USB_HS_D[9..0], USB_HS_DIR, USB_HS_NXT, USB_HS_RESET, USB_HS_STP

### Library data of the parts
C27 C108-C110 = CAP0402-CAP: as C39 on sheet mix1_LO1
R23-R25 R46 R47 R60-R62 R64 = Res2: Resistor; Value: 0Ohm; Published: 8-Jun-2000; LatestRevisionDate: 17-Jul-2002; LatestRevisionNote: Re-released for DXP Platform.; PackageReference: AXIAL-0.4; Publisher: Altium Limited; PackageDescription: Axial Device, Thru-Hole; 2 Leads; 0.4 in Pin Spacing
USB2 = USB_Micro_TypeB: Connector SMD USB Micro Type B middle mount; Manufacturer 1: Molex Inc; SCDType: undef; Package / Case: SMD; Supplier 1: Digi-Key; Supplier Part Number 1: WM17142CT-ND
X2 = OSCILLATOR-3.2X2.5: Crystal Oscillator in 3.2x2.5 SMD

## Sheet power.SchDoc
size A4
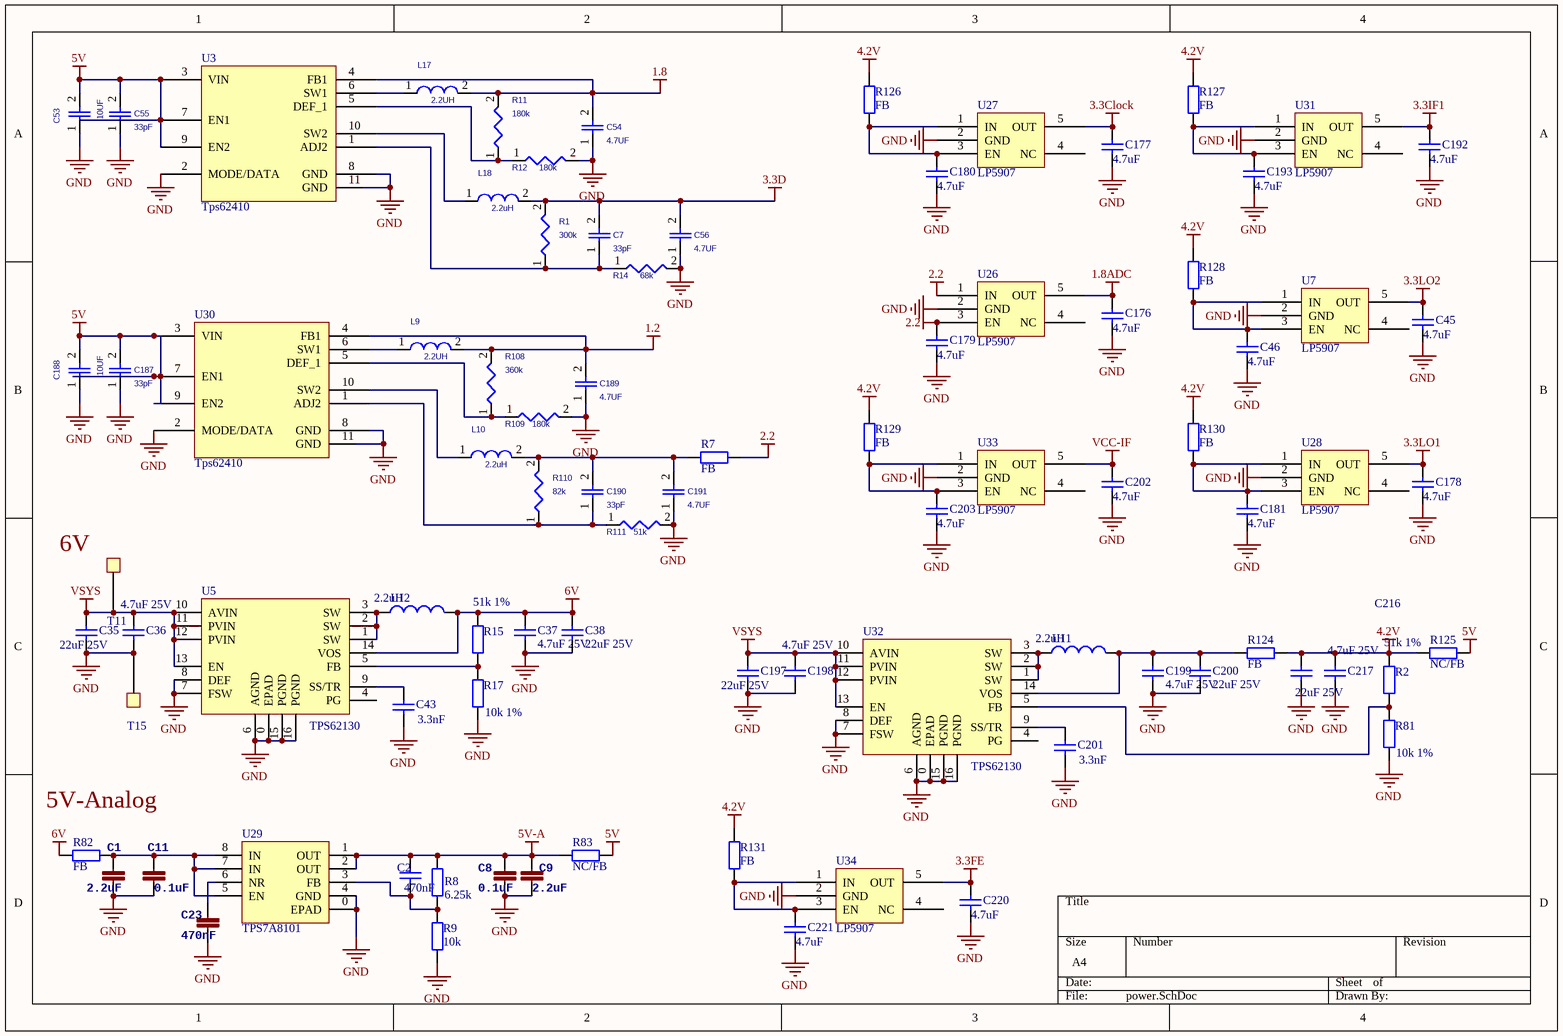
[diagram p7: power.SchDoc]

### Parts
C1  2.2uF  [0603]
C2  470nF  [0402]
C7  33pF  [0402]
C8  0.1uF  [0603]
C9  2.2uF  [0603]
C11  0.1uF  [0402]
C23  470nF  [0402]
C35  value 22uF 25V  [0805]  (hidden comment: Cap)
C36  value 4.7uF 25V  [0603]  (hidden comment: Cap)
C37  value 4.7uF 25V  [0603]  (hidden comment: Cap)
C38  value 22uF 25V  [0805]  (hidden comment: Cap)
C43  3.3nF  [0402]
C45  4.7uF  [0603]
C46  4.7uF  [0603]
C53  10UF  [0805]
C54  4.7UF  [0805]
C55  33pF  [0603]
C56  4.7UF  [0805]
C176  4.7uF  [0603]
C177  4.7uF  [0603]
C178  4.7uF  [0603]
C179  4.7uF  [0603]
C180  4.7uF  [0603]
C181  4.7uF  [0603]
C187  33pF  [0603]
C188  10UF  [0805]
C189  4.7UF  [0805]
C190  33pF  [0402]
C191  4.7UF  [0805]
C192  4.7uF  [0603]
C193  4.7uF  [0603]
C197  value 22uF 25V  [0805]  (hidden comment: Cap)
C198  value 4.7uF 25V  [0603]  (hidden comment: Cap)
C199  value 4.7uF 25V  [0603]  (hidden comment: Cap)
C200  value 22uF 25V  [0805]  (hidden comment: Cap)
C201  3.3nF  [0402]
C202  4.7uF  [0603]
C203  4.7uF  [0603]
C216  value 4.7uF 25V  [0603]  (hidden comment: Cap)
C217  value 22uF 25V  [0805]  (hidden comment: Cap)
C220  4.7uF  [0603]
C221  4.7uF  [0603]
L9  2.2UH  [0806]
L10  2.2uH  [0806]
L11  2.2uH  [L4015]
L12  2.2uH  [L4015]
L17  2.2UH  [0806]
L18  2.2uH  [0806]
R1  300k  [0402]
R2  51k 1%  [0402]
R7  FB  [0603]
R8  6.25k  [0402]
R9  10k  [0402]
R11  180k  [0402]
R12  180k  [0402]
R14  68k  [0402]
R15  51k 1%  [0402]
R17  10k 1%  [0402]
R81  10k 1%  [0402]
R82  FB  [0603]
R83  NC/FB  [0603]
R108  360k  [0402]
R109  180k  [0402]
R110  82k  [0402]
R111  51k  [0402]
R124  FB  [0603]
R125  NC/FB  [0603]
R126  FB  [0603]
R127  FB  [0603]
R128  FB  [0603]
R129  FB  [0603]
R130  FB  [0603]
R131  FB  [0603]
T11  TestPad  [TestPad]  (value not drawn)
T15  TestPad  [TestPad]  (value not drawn)
U3  Tps62410  [DFN-10P-3X3]
U5  TPS62130  [TPS62130]
U7  LP5907  [SOT23-5]
U26  LP5907  [SOT23-5]
U27  LP5907  [SOT23-5]
U28  LP5907  [SOT23-5]
U29  TPS7A8101  [TPS7A8101]
U30  Tps62410  [DFN-10P-3X3]
U31  LP5907  [SOT23-5]
U32  TPS62130  [TPS62130]
U33  LP5907  [SOT23-5]
U34  LP5907  [SOT23-5]

### Nets
1.2: C189.2 L9.2 R108.2 U30.4(FB1)
1.8: C54.2 L17.2 R11.2 U3.4(FB1)
1.8ADC: C176.2 U26.5(OUT)
2.2: C179.2 R7.1 U26.1(IN) U26.3(EN)
3.3Clock: C177.2 U27.5(OUT)
3.3D: C7.2 C56.2 L18.2 R1.2
3.3FE: C220.2 U34.5(OUT)
3.3IF1: C192.2 U31.5(OUT)
3.3LO1: C178.2 U28.5(OUT)
3.3LO2: C45.2 U7.5(OUT)
4.2V: C216.2 C217.2 R2.1 R124.1 R125.2 R126.1 R127.1 R128.1 R129.1 R130.1 R131.1
5V: C53.2 C55.2 C187.2 C188.2 R83.1 R125.1 U3.3(VIN) U3.7(EN1) U3.9(EN2) U30.3(VIN) U30.7(EN1) U30.9(EN2)
5V-A: C2.1 C8.2 C9.2 R8.1 R83.2 U29.1(OUT) U29.2(OUT)
6V: C37.2 C38.2 L12.2 R15.1 R82.2 U5.14(VOS)
GND: C1.1 C8.1 C9.1 C11.1 C23.1 C35.2 C36.2 C37.1 C38.1 C43.2 C45.1 C46.1 C53.1 C54.1 C55.1 C56.1 C176.1 C177.1 C178.1 C179.1 C180.1 C181.1 C187.1 C188.1 C189.1 C191.1 C192.1 C193.1 C197.2 C198.2 C199.1 C200.1 C201.2 C202.1 C203.1 C216.1 C217.1 C220.1 C221.1 R9.2 R12.2 R14.2 R17.2 R81.2 R109.2 R111.2 T15.1 U3.2(MODE/DATA) U3.8(GND) U3.11(GND) U5.0(EPAD) U5.6(AGND) U5.7(FSW) U5.8(DEF) U5.15(PGND) U5.16(PGND) U7.2(GND) U26.2(GND) U27.2(GND) U28.2(GND) U29.0(EPAD) U29.4(GND) U30.2(MODE/DATA) U30.8(GND) U30.11(GND) U31.2(GND) U32.0(EPAD) U32.6(AGND) U32.7(FSW) U32.8(DEF) U32.15(PGND) U32.16(PGND) U33.2(GND) U34.2(GND)
VCC-IF: C202.2 U33.5(OUT)
VSYS: C35.1 C36.1 C197.1 C198.1 T11.1 U5.10(AVIN) U5.11(PVIN) U5.12(PVIN) U5.13(EN) U32.10(AVIN) U32.11(PVIN) U32.12(PVIN) U32.13(EN)
NetC1_2: C1.2 C11.2 R82.1 U29.5(EN) U29.7(IN) U29.8(IN)
NetC2_2: C2.2 R8.2 R9.1 U29.3(FB)
NetC7_1: C7.1 R1.1 R14.1 U3.1(ADJ2)
NetC23_2: C23.2 U29.6(NR)
NetC43_1: C43.1 U5.9(SS/TR)
NetC46_2: C46.2 R128.2 U7.1(IN) U7.3(EN)
NetC180_2: C180.2 R126.2 U27.1(IN) U27.3(EN)
NetC181_2: C181.2 R130.2 U28.1(IN) U28.3(EN)
NetC190_1: C190.1 R110.1 R111.1 U30.1(ADJ2)
NetC190_2: C190.2 C191.2 L10.2 R7.2 R110.2
NetC193_2: C193.2 R127.2 U31.1(IN) U31.3(EN)
NetC199_2: C199.2 C200.2 L11.2 R124.2 U32.14(VOS)
NetC201_1: C201.1 U32.9(SS/TR)
NetC203_2: C203.2 R129.2 U33.1(IN) U33.3(EN)
NetC221_2: C221.2 R131.2 U34.1(IN) U34.3(EN)
NetL9_1: L9.1 U30.6(SW1)
NetL10_1: L10.1 U30.10(SW2)
NetL11_1: L11.1 U32.1(SW) U32.2(SW) U32.3(SW)
NetL12_1: L12.1 U5.1(SW) U5.2(SW) U5.3(SW)
NetL17_1: L17.1 U3.6(SW1)
NetL18_1: L18.1 U3.10(SW2)
NetR2_2: R2.2 R81.1 U32.5(FB)
NetR11_1: R11.1 R12.1 U3.5(DEF_1)
NetR15_2: R15.2 R17.1 U5.5(FB)
NetR108_1: R108.1 R109.1 U30.5(DEF_1)

Not connected (* = marked no-connect by the designer): U5 4(PG); U7 4(NC); U26 4(NC); U27 4(NC); U28 4(NC); U31 4(NC); U32 4(PG); U33 4(NC); U34 4(NC)

### Notes on the sheet
- (near T11) 6V
- 5V-Analog

### Library data of the parts
C1 C8 C9 C11 C23 = CAP0402-CAP: as C39 on sheet mix1_LO1
C2 C35-C38 C43 C45 C46 C176-C181 C192 C193 C197-C203 C216 C217 C220 C221 = Cap: Capacitor; Published: 8-Jun-2000; LatestRevisionDate: 17-Jul-2002; LatestRevisionNote: Re-released for DXP Platform.; PackageReference: RAD-0.3; Publisher: Altium Limited; PackageDescription: Radial Cap, Thru-Hole; 2 Leads; 0.3 in Pin Spacing
C7 C190 = CAP/0402: 1st Part Field: 0402
C53-C56 C187-C189 C191 = CAP/0402: 1st Part Field: 0402
L9 L10 L17 L18 = L/2.5*2.0
L11 L12 = Inductor: Code_IEC: 1005; Published: 8-Jun-2000; LatestRevisionDate: 29-May-2009; LatestRevisionNote: IPC-7351 Footprint Added.; PackageReference: 0402-A; Publisher: Altium Limited; PackageDescription: Chip Inductor; Code_JEITA: 0402
R1 R11 R12 R14 R108-R111 = RES/0402_3
R2 R15 R17 R81 = Res2: Resistor; Published: 8-Jun-2000; LatestRevisionDate: 17-Jul-2002; LatestRevisionNote: Re-released for DXP Platform.; PackageReference: AXIAL-0.4; Publisher: Altium Limited; PackageDescription: Axial Device, Thru-Hole; 2 Leads; 0.4 in Pin Spacing
R7-R9 R82 R83 R124-R131 = Res2: Resistor; Value: 0Ohm; Published: 8-Jun-2000; LatestRevisionDate: 17-Jul-2002; LatestRevisionNote: Re-released for DXP Platform.; PackageReference: AXIAL-0.4; Publisher: Altium Limited; PackageDescription: Axial Device, Thru-Hole; 2 Leads; 0.4 in Pin Spacing

## Sheet clock.SchDoc
size A4
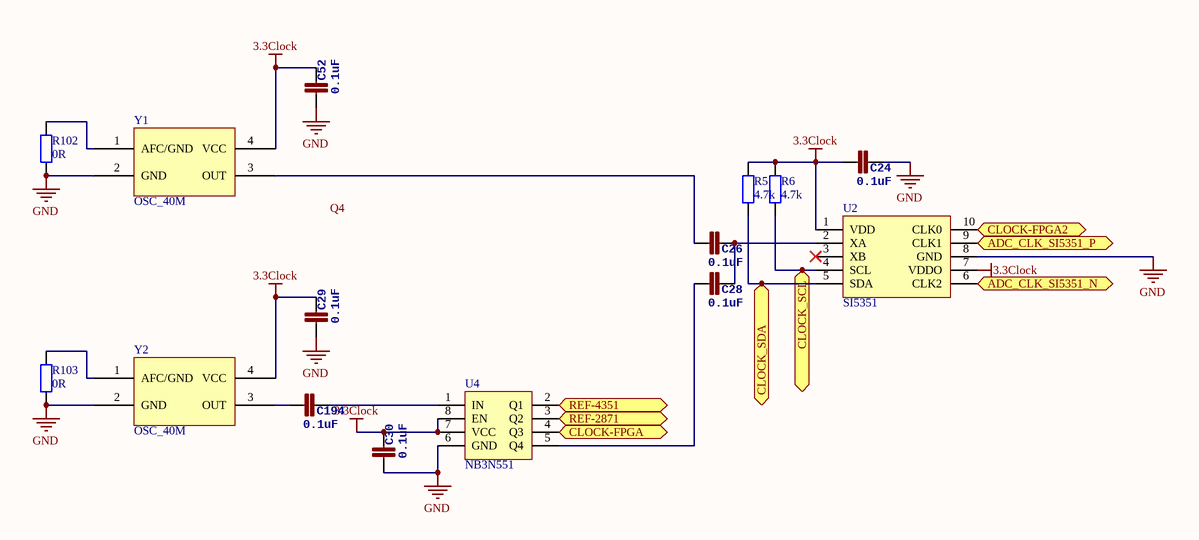
[diagram p8: clock.SchDoc]

### Parts
C24  0.1uF  [0402]
C26  0.1uF  [0402]
C28  0.1uF  [0402]
C29  0.1uF  [0402]
C30  0.1uF  [0402]
C52  0.1uF  [0402]
C194  0.1uF  [0402]
R5  4.7k  [0402]
R6  4.7k  [0402]
R102  0R  [0402]
R103  0R  [0402]
U2  SI5351  [MSOP10/VSSOP10]
U4  NB3N551  [SO8]
Y1  OSC_40M  [TXC_7Q]
Y2  OSC_40M  [TXC_7Q]

### Ports
ADC_CLK_SI5351_N, ADC_CLK_SI5351_P, CLOCK-FPGA, CLOCK-FPGA2, CLOCK_SCL, CLOCK_SDA, REF-2871, REF-4351

### Nets
3.3Clock: C24.1 C29.2 C30.2 C52.2 R5.1 R6.1 U2.1(VDD) U2.7(VDDO) U4.7(VCC) U4.8(EN) Y1.4(VCC) Y2.4(VCC)
GND: C24.2 C29.1 C30.1 C52.1 R102.2 R103.2 U2.8(GND) U4.6(GND) Y1.2(GND) Y2.2(GND)
NetC26_1: C26.1 Y1.3(OUT)
NetC26_2: C26.2 C28.2 U2.2(XA)
NetC28_1: C28.1 U4.5(Q4)
NetC170_1: U2.9(CLK1) ; port ADC_CLK_SI5351_P
NetC171_1: U2.6(CLK2) ; port ADC_CLK_SI5351_N
NetC194_1: C194.1 Y2.3(OUT)
NetC194_2: C194.2 U4.1(IN)
NetC218_1: U4.2(Q1) ; port REF-4351
NetC219_1: U4.3(Q2) ; port REF-2871
NetR5_2: R5.2 U2.5(SDA) ; port CLOCK_SDA
NetR6_2: R6.2 U2.4(SCL) ; port CLOCK_SCL
NetR102_1: R102.1 Y1.1(AFC/GND)
NetR103_1: R103.1 Y2.1(AFC/GND)
NetU1_H5: U4.4(Q3) ; port CLOCK-FPGA
NetU1_J6: U2.10(CLK0) ; port CLOCK-FPGA2

Not connected (* = marked no-connect by the designer): U2 3(XB)*

### Notes on the sheet
- Labels drawn without touching a wire or pin: Q4

### Library data of the parts
C24 C26 C28-C30 C52 C194 = CAP0402-CAP: as C39 on sheet mix1_LO1
R5 R6 R102 R103 = Res2: Resistor; Published: 8-Jun-2000; LatestRevisionDate: 17-Jul-2002; LatestRevisionNote: Re-released for DXP Platform.; PackageReference: AXIAL-0.4; Publisher: Altium Limited; PackageDescription: Axial Device, Thru-Hole; 2 Leads; 0.4 in Pin Spacing